# EasyEDA Pro project Modu-PI Motherboard.epro, board PCB1
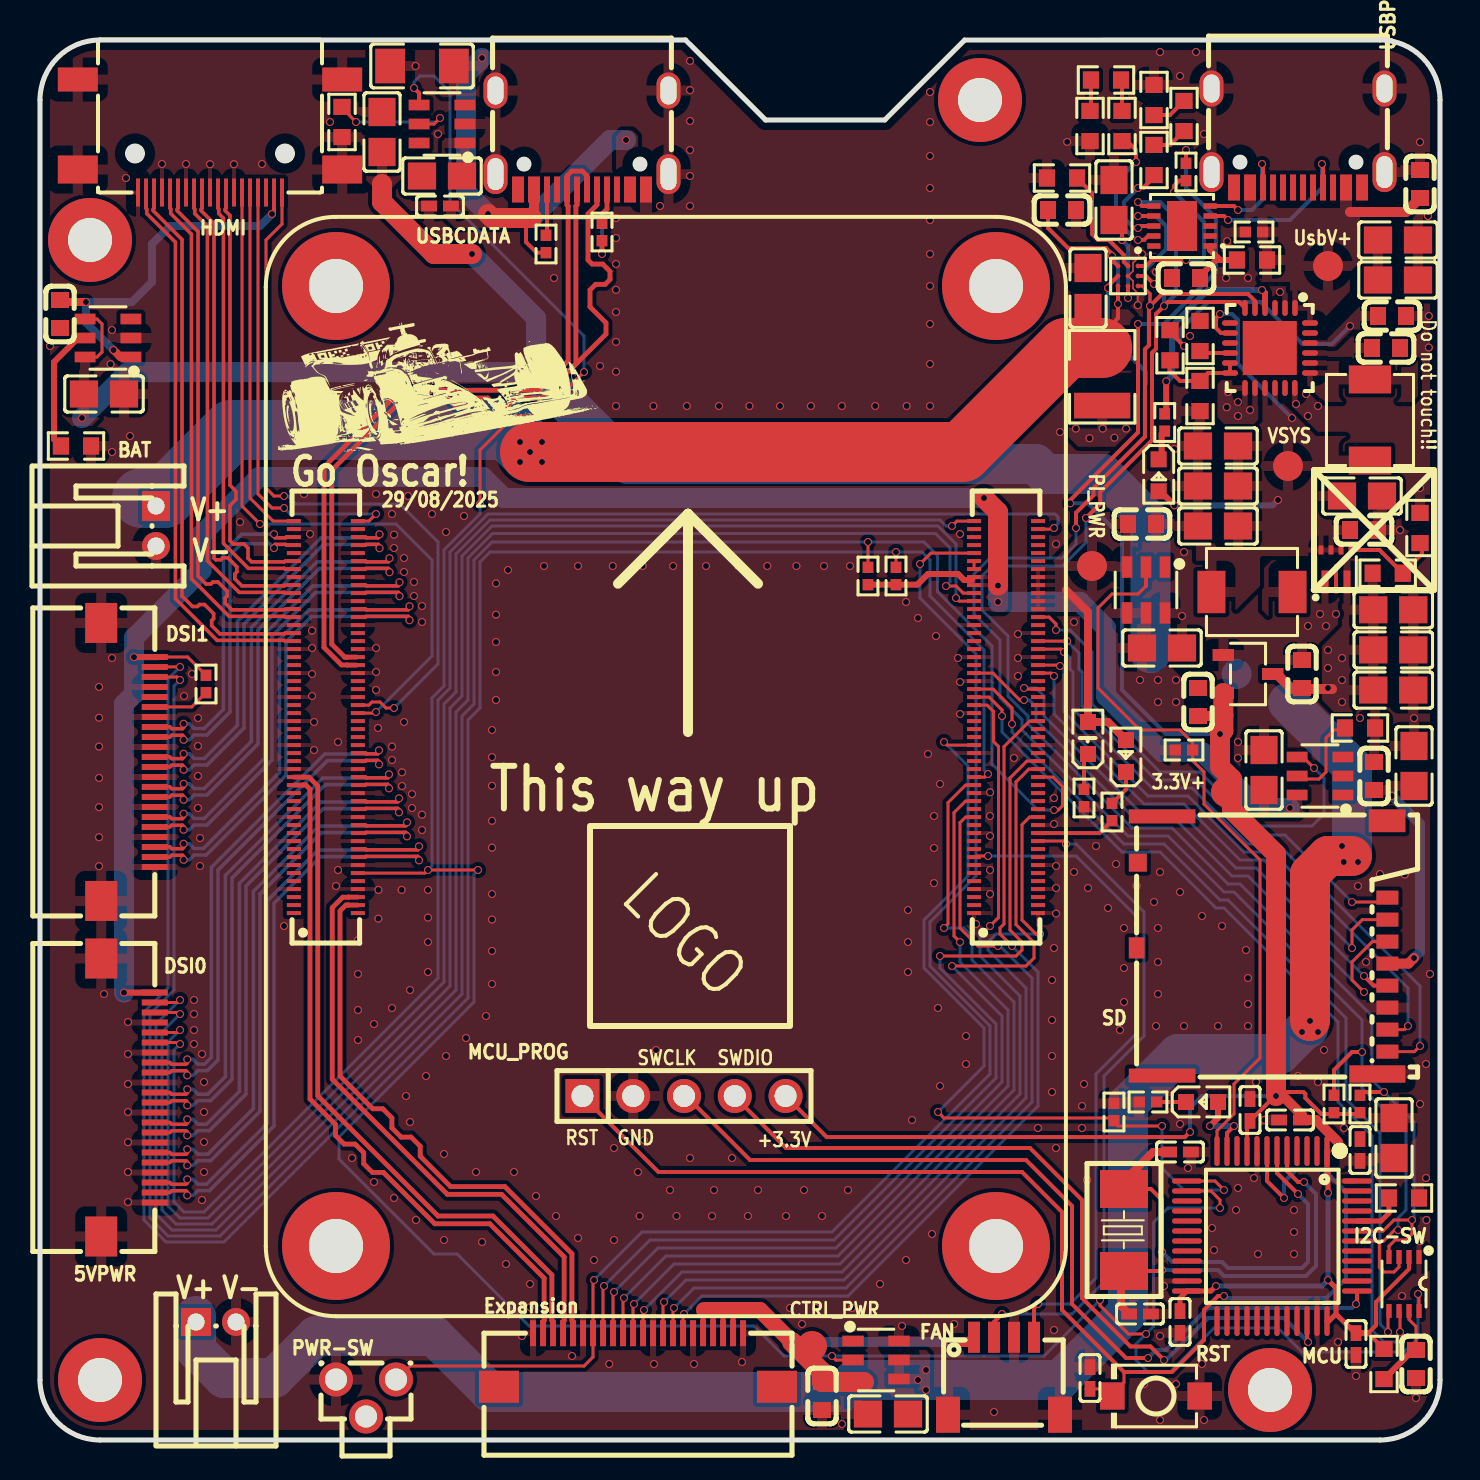
[diagram p1: board, top side]
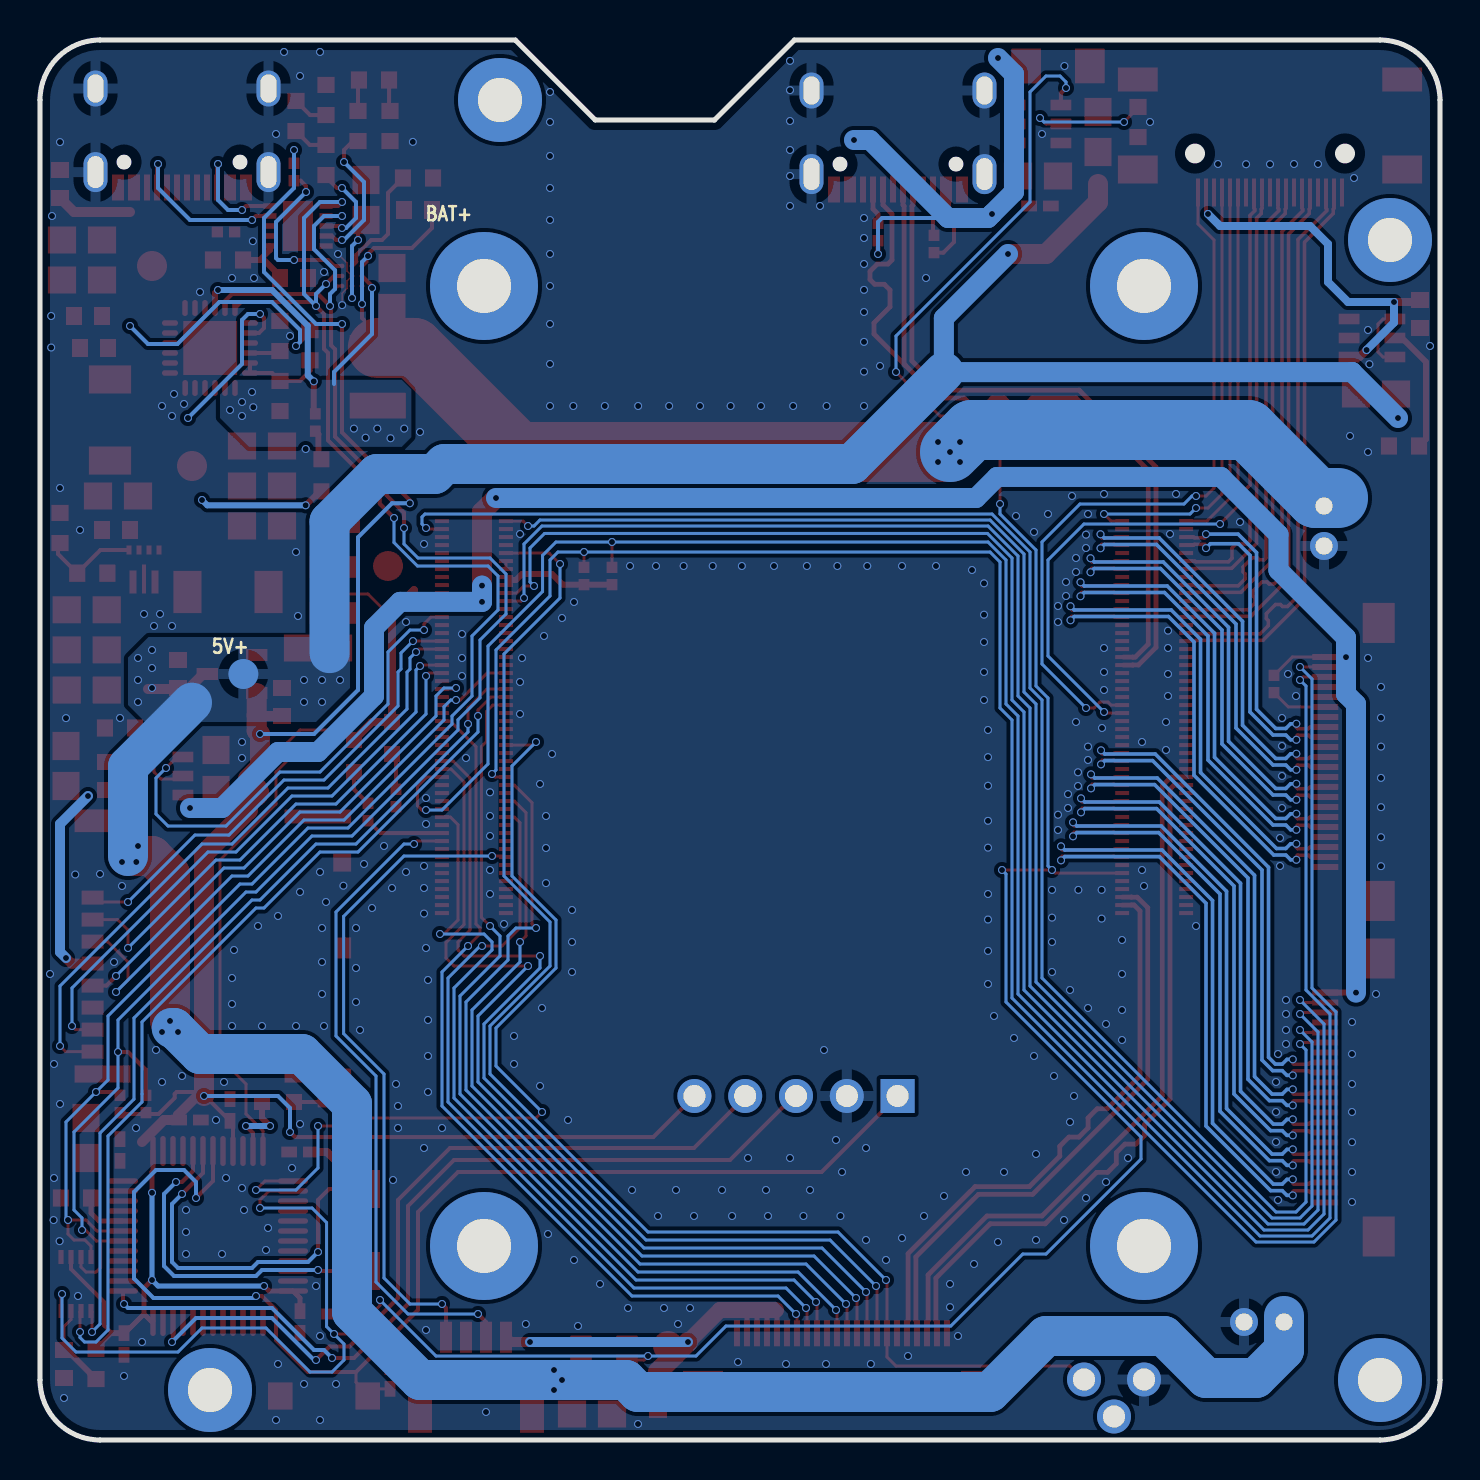
[diagram p2: board, bottom side, seen from below]

Outline 70 x 70 mm; copper layers: Top Layer, Inner1, Inner2, Bottom Layer. Coordinates in mm from the lower left corner of the outline.
Outline path: 0,67 0,3 arc(0.88,0.88) 3,0 67,0 arc(69.12,0.88) 70,3 70,67 arc(69.12,69.12) 67,70 46.23,70 42.24,66 36.28,66 32.28,70 3,70 arc(0.88,69.12) 0,67
Stack: Top Layer 0.035mm 外层铜厚1oz / Dielectric1 0.2104mm 7628 RC49% 8.6mil / Inner1 0.0152mm 内层铜厚 / Dielectric2 1.065mm 1.1mm H/HOZ 含铜 / Inner2 0.0152mm 内层铜厚 / Dielectric3 0.2104mm 7628 RC49% 8.6mil / Bottom Layer 0.035mm 外层铜厚1oz

## Design rules (mm)
net MIPI1_D2_N: 100OHM, MIPI2
net HDMI0_SCL: 100OHM
net MIPI1_D3_P: 100OHM, MIPI1
net MIPI1_D2_P: 100OHM, MIPI2
net HDMI0_SDA: 100OHM
net MIPI1_D3_N: 100OHM, MIPI1
net MIPI1_C_P: 100OHM, MIPI5
net HDMI0_CLK_N: 100OHM, HDMI8
net HDMI0_CLK_P: 100OHM, HDMI8
net MIPI1_C_N: 100OHM, MIPI5
net HDMI0_TX0_N: 100OHM, HDMI7
net MIPI1_D1_P: 100OHM, MIPI3
net HDMI0_TX0_P: 100OHM, HDMI7
net MIPI1_D1_N: 100OHM, MIPI3
net HDMI0_TX1_N: 100OHM, HDMI6
net MIPI1_D0_P: 100OHM, MIPI4
net HDMI0_TX1_P: 100OHM, HDMI6
net MIPI1_D0_N: 100OHM, MIPI4
net HDMI0_TX2_N: 100OHM, HDMI5
net USB3-1-TX_P: 90OHM, USB3
net HDMI0_TX2_P: 100OHM, HDMI5
net USB3-1-TX_N: 90OHM, USB3
net HDMI1_CLK_N: 100OHM, HDMI4
net USB3-1-D_N: 90OHM, USB5
net HDMI1_CLK_P: 100OHM, HDMI4
net USB3-1-D_P: 90OHM, USB5
net HDMI1_TX0_N: 100OHM, HDMI3
net USB3-1-RX_P: 90OHM, USB4
net HDMI1_TX0_P: 100OHM, HDMI3
net USB3-1-RX_N: 90OHM, USB4
net HDMI1_TX1_N: 100OHM, HDMI2
net HDMI0_HOTPLUG: 100OHM
net HDMI1_TX1_P: 100OHM, HDMI2
net HDMI0_CEC: 100OHM
net HDMI1_CEC: 100OHM
net HDMI1_TX2_N: 100OHM, HDMI1
net HDMI1_SCL: 100OHM
net HDMI1_TX2_P: 100OHM, HDMI1
net HDMI1_SDA: 100OHM
net HDMI1_HOTPLUG: 100OHM
net USB3-0-TX_P: 90OHM, USB6
net MIPI0_D3_P: 100OHM, MIPI6
net MIPI0_D3_N: 100OHM, MIPI6
net USB3-0-TX_N: 90OHM, USB6
net USB3-0-D_N: 90OHM, USB8
net MIPI0_D2_P: 100OHM, MIPI7
net USB3-0-D_P: 90OHM, USB8
net MIPI0_D2_N: 100OHM, MIPI7
net MIPI0_C_P: 100OHM, MIPI10
net USB3-0-RX_P: 90OHM, USB7
net USB3-0-RX_N: 90OHM, USB7
net MIPI0_C_N: 100OHM, MIPI10
net MIPI0_D1_P: 100OHM, MIPI8
net MIPI0_D1_N: 100OHM, MIPI8
net MIPI0_D0_P: 100OHM, MIPI9
net MIPI0_D0_N: 100OHM, MIPI9
net USB2_P: 90OHM, USB9
net USB2_N: 90OHM, USB9
template: User Custom Config
spacing copperThickness1oz (default): track to track 0.102, other pairs 0.09 to 0.3
spacing copperThickness2oz: track to track 0.203, other pairs 0.152 to 0.3
track width copperThickness1oz (default): min 0.05, default 0.254, max 4
track width copperThickness2oz: min 0.203, default 0.254, max 2.54
differential pair differentialPair (default): width min 0.127, default 0.254, max 2.54; gap min 0.152, default 0.152
differential pair 100OHM: width min 0.177, default 0.177, max 0.177; gap min 0.15, default 0.15
differential pair 90OHM: width min 0.239, default 0.239, max 0.239; gap min 0.15, default 0.15
via viaSize (default): diameter min 0.4, default 0.61, max 10; hole min 0.3, default 0.305, max 6.3
net GND uses copperRegion1
net MIPI1_D2_N uses 100OHM
net MIPI1_D3_P uses 100OHM
net MIPI1_D2_P uses 100OHM
net MIPI1_D3_N uses 100OHM
net MIPI1_C_P uses 100OHM
net HDMI0_CLK_N uses 100OHM
net HDMI0_CLK_P uses 100OHM
net MIPI1_C_N uses 100OHM
net HDMI0_TX0_N uses 100OHM
net MIPI1_D1_P uses 100OHM
net HDMI0_TX0_P uses 100OHM
net MIPI1_D1_N uses 100OHM
net HDMI0_TX1_N uses 100OHM
net MIPI1_D0_P uses 100OHM
net HDMI0_TX1_P uses 100OHM
net MIPI1_D0_N uses 100OHM
net HDMI0_TX2_N uses 100OHM
net USB3-1-TX_P uses 90OHM
net HDMI0_TX2_P uses 100OHM
net USB3-1-TX_N uses 90OHM
net HDMI1_CLK_N uses 100OHM
net USB3-1-D_N uses 90OHM
net HDMI1_CLK_P uses 100OHM
net USB3-1-D_P uses 90OHM
net HDMI1_TX0_N uses 100OHM
net USB3-1-RX_P uses 90OHM
net HDMI1_TX0_P uses 100OHM
net USB3-1-RX_N uses 90OHM
net HDMI1_TX1_N uses 100OHM
net HDMI1_TX1_P uses 100OHM
net HDMI1_TX2_N uses 100OHM
net HDMI1_TX2_P uses 100OHM
net USB3-0-TX_P uses 90OHM
net MIPI0_D3_P uses 100OHM
net MIPI0_D3_N uses 100OHM
net USB3-0-TX_N uses 90OHM
net USB3-0-D_N uses 90OHM
net MIPI0_D2_P uses 100OHM
net USB3-0-D_P uses 90OHM
net MIPI0_D2_N uses 100OHM
net MIPI0_C_P uses 100OHM
net USB3-0-RX_P uses 90OHM
net USB3-0-RX_N uses 90OHM
net MIPI0_C_N uses 100OHM
net MIPI0_D1_P uses 100OHM
net MIPI0_D1_N uses 100OHM
net MIPI0_D0_P uses 100OHM
net MIPI0_D0_N uses 100OHM
net USB2_P uses 90OHM
net USB2_N uses 90OHM
diff pair MIPI2 uses 100OHM
diff pair MIPI1 uses 100OHM
diff pair MIPI5 uses 100OHM
diff pair HDMI8 uses 100OHM
diff pair HDMI7 uses 100OHM
diff pair MIPI3 uses 100OHM
diff pair HDMI6 uses 100OHM
diff pair MIPI4 uses 100OHM
diff pair HDMI5 uses 100OHM
diff pair USB3 uses 90OHM
diff pair HDMI4 uses 100OHM
diff pair USB5 uses 90OHM
diff pair HDMI3 uses 100OHM
diff pair USB4 uses 90OHM
diff pair HDMI2 uses 100OHM
diff pair HDMI1 uses 100OHM
diff pair USB6 uses 90OHM
diff pair MIPI6 uses 100OHM
diff pair USB8 uses 90OHM
diff pair MIPI7 uses 100OHM
diff pair MIPI10 uses 100OHM
diff pair USB7 uses 90OHM
diff pair MIPI8 uses 100OHM
diff pair MIPI9 uses 100OHM
diff pair USB9 uses 90OHM
pour e2682 uses copperRegion1
pour e1232 uses copperRegion1
pour e576 uses copperRegion1
pour e601 uses copperRegion1
pour e205 uses copperRegion1
pour e148 uses copperRegion1
pour e136 uses copperRegion1
pour e124 uses copperRegion1
pour e149 uses copperRegion1
pour e95 uses copperRegion1
pour e29 uses copperRegion1
pour e36 uses copperRegion1
pour e737 uses copperRegion1
pour e132 uses copperRegion1
pour e47 uses copperRegion1
pour e665 uses copperRegion1
pour e463 uses copperRegion1
pour e5058 uses copperRegion1
pour e92 uses copperRegion1
pour e259 uses copperRegion1
pour e196 uses copperRegion1
pour e108 uses copperRegion1
pour e115 uses copperRegion1
pour e309 uses copperRegion1
pour e218 uses copperRegion1
pour e1586 uses copperRegion1
pour e1592 uses copperRegion1
pour e2314 uses copperRegion1
pour e842 uses copperRegion1
pour e1476 uses copperRegion1
pour e1207 uses copperRegion1

## Placement (name value [footprint] x y rotation side)
5VPWR  S2B-PH-K-S(LF)(SN)  [CONN-TH_S2B-PH-K-S-LF-SN]  8.8 5.9 180 top
BAT  S2B-PH-K-S(LF)(SN)  [CONN-TH_S2B-PH-K-S-LF-SN]  5.8 45.7 90 top
C3  10uF  [C0805]  17.1 65.4 90 top
C6  10uF  [C0805]  20.1 63.2 180 top
C9  10uF  [C0805]  68.7 33.7 90 top
C10  22uF  [C0805]  67.66 37.5 0 top
C11  22uF  [C0805]  67.66 39.5 0 top
C12  22uF  [C0805]  67.66 41.51 0 top
C17  1uF  [C0603]  66.2 45.5 0 top
C25  1uF  [C0603]  63.1 38.3 90 top
C26  10uF  [C0805]  67.7 15.1 90 top
C27  100nF  [C0402]  57 5.9 270 top
C28  100nF  [C0402]  60.5 16.5 90 top
C29  100nF  [C0402]  65.8 4.8 270 top
C30  100nF  [C0402]  62.5 16 180 top
C33  1uF  [C0603]  57.9 36.9 90 top
C38  47uF  [C1206]  19.1 68.7 180 top
C68  100nF  [C0402]  66 14.5 90 top
C69  100nF  [C0402]  52.5 3.1 90 top
C92  20pF  [C0402]  55 6.3 0 top
C93  20pF  [C0402]  57 14.4 0 top
C95  10uF  [C0805]  56.1 39.6 180 top
C96  1uF  [C0603]  55.1 45.8 180 top
C99  1uF  [C0603]  66.7 33.2 270 top
C100  10uF  [C0805]  61.2 33.5 270 top
C104  1uF  [C0603]  69 62.8 270 top
C105  4.7uF  [C0805]  67.9 58 0 top
C106  2.2uF  [C0805]  67.9 60 180 top
C107  47nF  [C0603]  67.3 54.6 180 top
C108  10uF  [C0805]  58.9 49.7 180 top
C109  10uF  [C0805]  58.9 45.7 180 top
C110  10uF  [C0805]  66.1 47.2 0 top
C111  10uF  [C0805]  58.9 47.7 180 top
C112  4.7uF  [C0603]  67.6 56.2 0 top
C113  10uF  [C0805]  52.4 57.6 90 top
C114  1uF  [C0603]  57.3 58.1 0 top
C115  1uF  [C0603]  39.1 2.2 90 top
C116  10uF  [C0805]  42.4 1.3 0 top
C118  100nF  [C0402]  20 61.7 180 top
C119  1uF  [C0603]  1 56.3 90 top
C120  10uF  [C0805]  3.2 52.3 180 top
C122  1uF  [C0603]  51.1 61.5 0 top
C123  2.2uF  [C0805]  53.7 62 270 top
C124  100pF  [C0603]  68.8 3.8 270 top
CN1  DF40C-100DS-0.4V(51)  [CONN-SMD_DF40C-100DS-0.4V-51]  48.3 36.15 270 top
CN2  DF40C-100DS-0.4V(51)  [CONN-SMD_DF40C-100DS-0.4V-51]  14.29 36.15 270 top
DSI0  AFC01-S22FCA-00  [FPC-SMD_P0.5-22P_FGS-XJ-H2.0]  4.4 17.13 90 top
DSI1  AFC01-S22FCA-00  [FPC-SMD_P0.5-22P_FGS-XJ-H2.0]  4.4 33.9 90 top
Expansion  AFC01-S22FCA-00  [FPC-SMD_P0.5-22P_FGS-XJ-H2.0]  29.9 4 180 top
FAN  SM04B-SRSS-TB(LF)(SN)  [CONN-SMD_4P-P1.00_SM04B-SRSS-TB-LF-SN]  48.2 3.2 0 top
HDMI  HDMI-519S  [HDMI-SMD_19P-P0.40-H-F_HDMI-519S]  8.5 65.2 180 top
I2C-SW  PCA9306DCUR  [SSOP-8_L2.0-W2.3-P0.50-LS3.1-BR]  68.2 7.8 90 top
L3  1uH  [IND-SMD_L4.4-W4.2]  60.6 42.4 180 top
L4  1uH  [IND-SMD_L4.4-W4.2]  66.5 51 90 top
LED4  KT-0603R  [LED0603-RD]  58.1 16.9 0 top
LED6  KT-0603R  [LED0603-RD]  55.93 48.23 270 top
LED7  KT-0603W  [LED0603-R-RD_WHITE]  52.4 35.1 90 top
LED8  KT-0603R  [LED0603-RD]  54.3 34.2 90 top
MCU  STM32F103C8T6  [LQFP-48_L7.0-W7.0-P0.50-LS9.0-BL]  61.6 10.2 180 top
MCU_PROG  PZ254V-11-05P  [HDR-TH_5P-P2.54-V-M]  32.2 17.2 0 top
NOREF  -  [Pad_e28]  47 67 0 top
NOREF#2  -  [Pad_e9417]  64.4 58.7 0 top
NOREF#3  -  [Pad_e9423]  59.3 32.4 0 top
NOREF#4  -  [Pad_e11]  2.5 60 0 top
NOREF#5  -  [Pad_e17]  3 3 0 top
NOREF#6  -  [Pad_e9421]  52.6 43.7 0 top
NOREF#7  -  [Pad_e9069]  47.8 9.7 0 top
NOREF#8  -  [Pad_e9425]  59.83 38.3 0 top
NOREF#9  -  [Pad_e9067]  47.8 57.7 0 top
NOREF#10  -  [Pad_e9065]  14.8 57.7 0 top
NOREF#11  -  [Pad_e9427]  38.6 4.7 0 top
NOREF#12  -  [Pad_e9068]  14.8 9.7 0 top
NOREF#13  -  [Pad_e18]  61.5 2.5 0 top
NOREF#14  -  [Pad_e3]  62.4 48.7 0 top
PWR-SW  BX-TS-26-454543BSJ  [sw-th_3p-l4.5-w4.3-p3.00-ls1.9]  16.3 2.1 0 top
R1  2.2kΩ  [R0402]  60.7 60.4 180 top
R3  2.2kΩ  [R0402]  8.3 37.8 270 top
R4  2.2kΩ  [R0402]  41.4 43.2 90 top
R5  2.2kΩ  [R0402]  42.8 43.2 90 top
R29  750kΩ  [R0603]  67.38 43.34 180 top
R30  100kΩ  [R0603]  69 45.6 270 top
R31  10kΩ  [R0603]  68.2 12.1 0 top
R32  1.5kΩ  [R0402]  55.4 16.9 180 top
R37  10kΩ  [R0402]  66 16.8 90 top
R38  10kΩ  [R0402]  64.7 16.8 90 top
R45  56kΩ  [R0402]  25.3 59.8 270 top
R46  56kΩ  [R0402]  28.1 60.4 270 top
R61  10kΩ  [R0603]  56.5 54.74 90 top
R62  10kΩ  [R0603]  58 52.2 90 top
R63  120Ω  [R0603]  58 55.2 90 top
R64  10Ω  [R0603]  60.6 59 0 top
R65  10kΩ  [R0603]  55.7 64 90 top
R66  2kΩ  [R0603]  57.2 66.2 90 top
R67  2kΩ  [R0603]  55.7 67 270 top
R69  5.6kΩ  [R0603]  53.3 68 0 top
R70  15kΩ  [R0603]  54.1 65.7 270 top
R71  2kΩ  [R0603]  52.5 65.7 90 top
R72  10kΩ  [R0402]  57.2 34.5 180 top
R75  2.2kΩ  [R0402]  56.23 50.88 270 top
R76  10kΩ  [R0603]  15.1 65.9 90 top
R77  10kΩ  [R0603]  66 35.6 180 top
R78  10kΩ  [R0603]  1.8 49.7 180 top
R79  10mΩ  [R1210]  53.11 53.16 270 top
R80  10kΩ  [R0603]  51.1 63.1 0 top
R81  10kΩ  [R0402]  57.3 63.4 270 top
R82  10kΩ  [R0402]  53.7 16.4 90 top
R84  2.2kΩ  [R0402]  53.6 31.4 90 top
R85  2.2kΩ  [R0402]  52.2 32.1 90 top
R86  200kΩ  [R0603]  67.2 3.8 90 top
RST  TS-1088-AR02016  [SW-SMD_L3.9-W3.0-P4.45]  55.8 2.2 180 top
SD  5033981892  [TF-SMD_503398-1892]  61.1 24.7 270 top
U9  TPS61022RWUR  [VQFN-7_L2.0-W2.0-P0.55-TL_RWU]  64.8 43.7 90 top
U19  ETA7014S2G  [SOT-23-6_L2.9-W1.6-P0.95-LS2.8-BL]  55.3 42.5 180 top
U23  BQ24192RGER  [QFN-24_L4.0-W4.0-P0.50-BL-EP2.7]  61.5 54.6 180 top
U24  HUSB238_002DD  [DFN-10_L3.0-W3.0-P0.50-BL-EP2.5]  57.1 60.7 90 top
U25  ETA7014S2G  [SOT-23-6_L2.9-W1.6-P0.95-LS2.8-BL]  41.8 4 270 top
U26  XC6206P332MR-G  [SOT-23-3_L2.9-W1.6-P1.90-LS2.8-BR]  60.4 38.3 180 top
U27  AP22615AWU-7  [SOT-26_L3.0-W1.6-P0.95-LS2.8-BL]  20.1 65.8 90 top
U28  AP22615AWU-7  [SOT-26_L3.0-W1.6-P0.95-LS2.8-BL]  64 33.2 90 top
U29  AP22615AWU-7  [SOT-26_L3.0-W1.6-P0.95-LS2.8-BL]  3.4 55.1 90 top
U30  BQ27220YZFR  [DSBGA-9_L1.7-W1.6-R3-C3-P0.50-BL]  54.4 58.2 180 top
USBCDATA  TYPE-C-31-M-12  [USB-C_SMD-TYPE-C-31-M-12]  27.1 65 180 top
USBPWR  TYPE-C-31-M-12  [USB-C_SMD-TYPE-C-31-M-12]  62.9 65.1 180 top
X2  8MHz  [CRYSTAL-SMD_L5.0-W3.2]  54.2 10.5 270 top

## Footprints (pads in the part's own frame, mm; a bottom-side part is the same pattern mirrored in y, then rotated)
C0402
  rect 0.79x0.54 smd: 1(-0.545,0) 2(0.545,0)
C0603
  rect 0.8x0.9 smd: 1(-0.7,0) 2(0.7,0)
C0805
  rect 1.41x1.35 smd: 1(-1,0) 2(1,0)
C1206
  rect 1.485x1.728 smd: 1(-1.593,0) 2(1.593,0)
CONN-SMD_4P-P1.00_SM04B-SRSS-TB-LF-SN
  rect 0.6x1.55 smd: 1(-1.5,1.938) 2(-0.5,1.938) 3(0.5,1.938) 4(1.5,1.938)
  rect 1.2x1.8 smd: 5(2.8,-1.938) 6(-2.8,-1.938)
CONN-SMD_DF40C-100DS-0.4V-51
  rect 0.2x0.7 smd: 1(9.8,1.6) 2(9.8,-1.6) 3(9.4,1.6) 4(9.4,-1.6) 5(9,1.6) 6(9,-1.6) 7(8.6,1.6) 8(8.6,-1.6) 9(8.2,1.6) 10(8.2,-1.6) 11(7.8,1.6) 12(7.798,-1.6) 13(7.4,1.6) 14(7.4,-1.6) 15(7,1.6) 16(7,-1.6) 17(6.6,1.6) 18(6.6,-1.6) 19(6.2,1.6) 20(6.2,-1.6) 21(5.8,1.6) 22(5.8,-1.6) 23(5.4,1.6) 24(5.4,-1.6) 25(5,1.6) 26(5,-1.6) 27(4.6,1.6) 28(4.6,-1.6) 29(4.2,1.6) 30(4.2,-1.6) 31(3.8,1.6) 32(3.8,-1.6) 33(3.4,1.6) 34(3.4,-1.6) 35(3,1.6) 36(3,-1.6) 37(2.6,1.6) 38(2.6,-1.6) 39(2.2,1.6) 40(2.2,-1.6) 41(1.8,1.6) 42(1.8,-1.6) 43(1.4,1.6) 44(1.4,-1.6) 45(1,1.6) 46(1,-1.6) 47(0.6,1.6) 48(0.6,-1.6) 49(0.2,1.6) 50(0.2,-1.6) 51(-0.2,1.6) 52(-0.2,-1.6) 53(-0.6,1.6) 54(-0.6,-1.6) 55(-1,1.6) 56(-1,-1.6) 57(-1.4,1.6) 58(-1.4,-1.6) 59(-1.8,1.6) 60(-1.8,-1.6) 61(-2.2,1.6) 62(-2.2,-1.6) 63(-2.6,1.6) 64(-2.6,-1.6) 65(-3,1.6) 66(-3,-1.6) 67(-3.4,1.6) 68(-3.4,-1.6) 69(-3.8,1.6) 70(-3.8,-1.6) 71(-4.2,1.6) 72(-4.2,-1.6) 73(-4.6,1.6) 74(-4.6,-1.6) 75(-5,1.6) 76(-5,-1.6) 77(-5.4,1.6) 78(-5.4,-1.6) 79(-5.8,1.6) 80(-5.8,-1.6) 81(-6.2,1.6) 82(-6.2,-1.6) 83(-6.6,1.6) 84(-6.6,-1.6) 85(-7,1.6) 86(-7,-1.6) 87(-7.4,1.6) 88(-7.4,-1.6) 89(-7.8,1.6) 90(-7.8,-1.6) 91(-8.2,1.6) 92(-8.2,-1.6) 93(-8.6,1.6) 94(-8.6,-1.6) 95(-9,1.6) 96(-9,-1.6) 97(-9.4,1.6) 98(-9.4,-1.6) 99(-9.8,1.6) 100(-9.8,-1.6)
CONN-TH_S2B-PH-K-S-LF-SN
  rect 1.5x1.4 hole 0.85: 1(1,0)
  round 1.4 hole 0.85: 2(-1,0)
CRYSTAL-SMD_L5.0-W3.2
  rect 1.9x2.4 smd: 1(-2.05,0) 2(2.05,0)
DFN-10_L3.0-W3.0-P0.50-BL-EP2.5
  rect 0.28x0.665 smd: 1(-1,-1.407) 2(-0.5,-1.407) 3(0,-1.407) 4(0.5,-1.407) 5(1,-1.407) 6(1,1.407) 7(0.5,1.407) 8(0,1.407) 9(-0.5,1.407) 10(-1,1.407)
  rect 2.5x1.5 smd: 11(0,0)
DSBGA-9_L1.7-W1.6-R3-C3-P0.50-BL
  round 0.24 smd: A1(-0.5,-0.5) A2(-0.5,0) A3(-0.5,0.5) B1(0,-0.5) B2(0,0) B3(0,0.5) C1(0.5,-0.5) C2(0.5,0) C3(0.5,0.5)
FPC-SMD_P0.5-22P_FGS-XJ-H2.0
  rect 0.3x1.3 smd: 1(-5.252,-1.338) 2(-4.752,-1.338) 3(-4.252,-1.338) 4(-3.752,-1.338) 5(-3.252,-1.338) 6(-2.752,-1.338) 7(-2.252,-1.338) 8(-1.752,-1.338) 9(-1.25,-1.339) 10(-0.752,-1.338) 11(-0.252,-1.338) 12(0.248,-1.338) 13(0.748,-1.338) 14(1.248,-1.338) 15(1.748,-1.338) 16(2.248,-1.338) 17(2.748,-1.338) 18(3.248,-1.338) 19(3.748,-1.338) 20(4.25,-1.339) 21(4.748,-1.338) 22(5.248,-1.338)
  rect 2x1.6 smd: 23(6.95,1.339) 24(-6.95,1.339)
HDMI-SMD_19P-P0.40-H-F_HDMI-519S
  rect 0.2x1.4 smd: 1(3.6,2.825) 2(3.2,2.825) 3(2.8,2.825) 4(2.4,2.825) 5(2,2.825) 6(1.6,2.825) 7(1.2,2.825) 8(0.8,2.825) 9(0.4,2.825) 10(0,2.824) 11(-0.4,2.825) 12(-0.8,2.825) 13(-1.2,2.825) 14(-1.6,2.825) 15(-2,2.825) 16(-2.4,2.825) 17(-2.8,2.825) 18(-3.2,2.825) 19(-3.6,2.825)
  rect 2x1.2 smd: 20(6.61,-2.825) 21(-6.61,-2.825)
  rect 2x1.4 smd: 22(6.61,1.675) 23(-6.61,1.675)
HDR-TH_5P-P2.54-V-M
  rect 1.7x1.7 hole 1.1: 1(-5.08,0)
  round 1.7 hole 1.1: 2(-2.54,0) 3(0,0) 4(2.54,0) 5(5.08,0)
IND-SMD_L4.4-W4.2
  rect 1.4x2.12 smd: 1(2.028,0) 2(-2.028,0)
LED0603-R-RD_WHITE
  rect 0.8x0.8 smd: 1(0.8,0) 2(-0.8,0)
LED0603-RD
  rect 0.8x0.8 smd: 1(-0.799,0) 2(0.799,0)
LQFP-48_L7.0-W7.0-P0.50-LS9.0-BL
  oval 0.27x1.5 smd: 1(-2.75,-4.25) 2(-2.25,-4.25) 3(-1.75,-4.25) 4(-1.25,-4.25) 5(-0.75,-4.25) 6(-0.25,-4.25) 7(0.25,-4.25) 8(0.75,-4.25) 9(1.25,-4.25) 10(1.75,-4.25) 11(2.25,-4.25) 12(2.75,-4.25) 25(2.75,4.25) 26(2.25,4.25) 27(1.75,4.25) 28(1.25,4.25) 29(0.75,4.25) 30(0.25,4.25) 31(-0.25,4.25) 32(-0.75,4.25) 33(-1.25,4.25) 34(-1.75,4.25) 35(-2.25,4.25) 36(-2.75,4.25)
  oval 1.5x0.27 smd: 13(4.25,-2.75) 14(4.25,-2.25) 15(4.25,-1.75) 16(4.25,-1.25) 17(4.25,-0.75) 18(4.25,-0.25) 19(4.25,0.25) 20(4.25,0.75) 21(4.25,1.25) 22(4.25,1.75) 23(4.25,2.25) 24(4.25,2.75) 37(-4.25,2.75) 38(-4.25,2.25) 39(-4.25,1.75) 40(-4.25,1.25) 41(-4.25,0.75) 42(-4.25,0.25) 43(-4.25,-0.25) 44(-4.25,-0.75) 45(-4.25,-1.25) 46(-4.25,-1.75) 47(-4.25,-2.25) 48(-4.25,-2.75)
Pad_e3
  round 1.5 smd: TP1(0,0)
Pad_e11
  round 4.2 hole 2.2: 101(0,0)
Pad_e17
  round 4.2 hole 2.2: 101(0,0)
Pad_e18
  round 4.2 hole 2.2: 101(0,0)
Pad_e28
  round 4.2 hole 2.2: 101(0,0)
Pad_e9065
  round 5.4 hole 2.7: 102(0,0)
Pad_e9067
  round 5.4 hole 2.7: 102(0,0)
Pad_e9068
  round 5.4 hole 2.7: 102(0,0)
Pad_e9069
  round 5.4 hole 2.7: 102(0,0)
Pad_e9417
  round 1.5 smd: TP1(0,0)
Pad_e9421
  round 1.5 smd: TP5(0,0)
Pad_e9423
  round 1.5 smd: TP7(0,0)
Pad_e9425
  round 1.5 smd far side: TP9(0,0)
Pad_e9427
  round 1.5 smd: TP11(0,0)
QFN-24_L4.0-W4.0-P0.50-BL-EP2.7
  oval 0.28x0.8 smd: 1(-1.25,-2) 2(-0.75,-2) 3(-0.25,-2) 4(0.25,-2) 5(0.75,-2) 6(1.25,-2) 13(1.25,2) 14(0.75,2) 15(0.25,2) 16(-0.25,2) 17(-0.75,2) 18(-1.242,2)
  oval 0.8x0.28 smd: 7(2,-1.25) 8(2,-0.75) 9(2,-0.25) 10(2,0.25) 11(2,0.75) 12(2,1.25) 19(-2,1.25) 20(-2,0.75) 21(-2,0.25) 22(-2,-0.25) 23(-2,-0.75) 24(-2,-1.25)
  rect 2.7x2.7 smd: 25(0.013,0)
R0402
  rect 0.566x0.54 smd: 1(-0.433,0) 2(0.433,0)
R0603
  rect 0.806x0.864 smd: 1(-0.753,0) 2(0.753,0)
R1210
  rect 1.282x2.808 smd: 1(-1.441,0) 2(1.441,0)
SOT-23-3_L2.9-W1.6-P1.90-LS2.8-BR
  rect 1.07x0.6 smd: 1(1.235,-0.95) 2(1.235,0.95) 3(-1.235,0)
SOT-23-6_L2.9-W1.6-P0.95-LS2.8-BL
  rect 0.532x1.072 smd: 1(-0.95,-1.149) 2(0,-1.149) 3(0.95,-1.149) 4(0.95,1.149) 5(0,1.149) 6(-0.95,1.149)
SOT-26_L3.0-W1.6-P0.95-LS2.8-BL
  rect 0.532x1.04 smd: 1(-0.95,-1.145) 2(0,-1.145) 3(0.95,-1.145) 4(0.95,1.145) 5(0,1.145) 6(-0.95,1.145)
SSOP-8_L2.0-W2.3-P0.50-LS3.1-BR
  rect 0.7x0.26 smd: 1(1.35,-0.75) 2(1.35,-0.25) 3(1.35,0.25) 4(1.35,0.75) 5(-1.35,0.75) 6(-1.35,0.25) 7(-1.35,-0.25) 8(-1.35,-0.75)
SW-SMD_L3.9-W3.0-P4.45
  rect 1.23x1.36 smd: 1(-2.185,0) 2(2.185,0)
sw-th_3p-l4.5-w4.3-p3.00-ls1.9
  round 1.7 hole 1.1: 1(-1.5,0.925) 2(1.5,0.925) 3(0,-0.925)
TF-SMD_503398-1892
  rect 0.7x1.1 smd: 1(-2.42,6.27) 2(-1.32,6.27) 3(-0.22,6.27) 4(0.88,6.27) 5(1.98,6.27) 6(3.08,6.27) 7(4.18,6.27) 8(5.28,6.27)
  rect 1.05x0.78 smd: 9(0.095,-6.27)
  rect 0.9x0.9 smd: 10(-4.17,-6.21)
  rect 0.7x3.33 smd: 11(-6.48,-4.995) 11(6.48,-4.995)
  rect 1.14x1.83 smd: 11(-6.26,6.255)
  rect 0.86x2.8 smd: 11(6.4,5.77)
USB-C_SMD-TYPE-C-31-M-12
  oval 1.2x2 hole 0.8x1.6: 0(-4.325,1.706) 1(4.325,1.706)
  oval 1.2x1.8 hole 0.8x1.4: 2(4.325,-2.474) 3(-4.325,-2.474)
  rect 0.3x1.3 smd: A1(-3.35,2.474) A4(-2.55,2.474) A5(-1.25,2.474) A6(-0.25,2.474) A7(0.25,2.474) A8(1.25,2.474) A9(2.55,2.474) A12(3.35,2.474) B1(3.05,2.474) B4(2.25,2.474) B5(1.75,2.474) B6(0.75,2.474) B7(-0.75,2.474) B8(-1.75,2.474) B9(-2.25,2.474) B12(-3.05,2.474)
VQFN-7_L2.0-W2.0-P0.55-TL_RWU
  rect 1.15x0.35 smd: 1(-0.8,0.55) 3(-0.8,-0.55)
  rect 1.45x0.2 smd: 2(-0.65,0)
  rect 0.45x0.25 smd: 4(0.8,-0.75) 5(0.8,-0.25) 6(0.8,0.25) 7(0.8,0.75)

## Nets
As in the schematic, except:
5V_CTRL: C115.2 Expansion.2 Expansion.3 Expansion.4 Expansion.5 FAN.1 NOREF#11.TP11 U25.3
+3.3VI: C26.1 C27.1 C28.1 C29.1 C30.1 C33.1 C68.1 I2C-SW.2 MCU.1 MCU.9 MCU.24 MCU.36 MCU.48 MCU_PROG.5 NOREF#3.TP7 R37.1 R38.1 R81.1 R86.2 U26.2
+5V: 5VPWR.1 C3.1 C10.1 C11.1 C12.1 C25.1 C95.2 C116.2 C120.2 NOREF#8.TP9 R29.2 U9.3 U19.4 U19.5 U25.4 U25.5 U26.3 U27.6 U29.4 U29.6
PI_PWR: C96.2 CN1.77 CN1.79 CN1.81 CN1.83 CN1.85 CN1.87 LED7.1 LED8.2 NOREF#6.TP5 U19.3
USB_V+: C104.2 NOREF#2.TP1 R1.1 R64.2 U23.1 U23.24 USBPWR.A4 USBPWR.A9 USBPWR.B4 USBPWR.B9
VSYS: C17.1 C108.1 C109.1 C110.1 C111.1 L3.1 L4.2 LED6.2 NOREF#14.TP1 U9.5 U9.6 U9.7 U23.8 U23.15 U23.16

Pads without a net: DSI1 18; Expansion 23 24; HDMI 17; MCU 2 3 4 10 15 16 17 18 19 20 21 22 25 26 27 28 29 30 31 32 33 38 39 40 41 45 46; NOREF 101; NOREF#4 101; NOREF#5 101; NOREF#7 102; NOREF#9 102; NOREF#10 102; NOREF#12 102; NOREF#13 101; PWR-SW 3; SD 9 10; U19 1; U23 3 7; U24 2 3 10; U25 1; U27 3; U28 3; U29 3; USBCDATA A8 B8; USBPWR A6 A7 A8 B6 B7 B8

## Via types
v1: diameter 0.4, hole 0.3, Top Layer to Bottom Layer, 593 vias

## Routing (per net, layer and track width the routed paths; a pad name or vN(x,y) marks a point on that pad's centre or on a via; arc(x,y) is an arc through that point)
5V_CTRL: length 24.5
  Top Layer w0.25: 33.65,5.14 33.65,6.5 33.65,6.5 ; 33.2,6.5 33.15,6.45 33.15,5.14 ; 34.15,5.14 34.15,6.47 34.12,6.5 ; 34.58,6.5 34.65,6.43 34.65,5.14
  Top Layer w0.5: FAN.1 46.46,4.9 v1(45.5,4.9)
  Top Layer w0.8: v1(37.6,4.9) 36,6.5 33.2,6.5
  Top Layer w1: v1(37.6,4.9) 39.1,3.4 C115.2 41.2,2.9
  Bottom Layer w0.5: v1(45.5,4.9) v1(37.6,4.9)
+1.8V: length 0.4
  Top Layer w0.15: CN1.90 CN1.88
+3.3V: length 102.8
  Top Layer w0.15: 8.3,38.23 7.38,39.15 5.91,39.15
  Top Layer w0.3: 5.91,39.15 5.9,39.14 v1(4.7,39.14) ; 46.6,43 46.2,43 45.9,43.3 44.4,43.3 43.87,42.77 41.4,42.77 ; 5.91,22.38 5.9,22.37 v1(4.2,22.37)
  Top Layer w1: v1(47.9,42.72) 47.9,46.4 v1(47.2,47.1)
  Bottom Layer w1: v1(47.9,42.72) v1(47.9,41.91) 52,41.91 53.3,40.61 53.3,37.2 56.1,34.4 58.1,34.4 60.9,31.6 v1(62.5,31.6) ; v1(47.2,47.1) 23.2,47.1 22.15,48.15 10.95,48.15 8.08,45.28 8.08,43.49 4.7,40.11 v1(4.7,39.14) 4.7,37.3 4.2,36.8 v1(4.2,22.37)
+3.3VI: length 126.7
  Top Layer w0.2: v1(57.3,64.5) R81.1 ; v1(51.51,46.84) 51.51,46.99 54.9,50.38 v1(54.9,55.8) ; R86.2 66.41,5.34 66.8,5.74 66.8,6.9 68.45,8.55 I2C-SW.2 ; v1(57.5,15.4) 57.25,15.15 39.33,15.15 MCU_PROG.5 ; R37.1 65.93,16.3 64.07,16.3 63.27,17.1 63.27,17.3 63.17,17.4 62,17.4 v1(61.8,17.2) 61.75,17.2 C28.1 60.35,15.8 MCU.9
  Top Layer w0.25: v1(64.4,8) 64.8,7.6 64.8,6.3 ; C27.1 57,7.1 MCU.24 58.55,7.45 v1(58.8,7.7) ; 64.8,6.3 64.45,5.95 MCU.36 ; 64.8,6.3 65.75,5.34 C29.1 ; v1(64.4,12.36) 64.4,13.4 64.35,13.45 MCU.1
  Top Layer w0.3: 66.41,5.34 C29.1
  Top Layer w0.5: 64.9,14.9 63.8,16 C30.1 63.1,16.05 63.1,16.24 62.15,17.2 v1(61.8,17.2) ; C33.1 59.13,36.2
  Top Layer w1: 59.13,36.2 59.16,36.23 ; 59.16,36.23 U26.2 ; 59.16,36.23 59.16,35.46 v1(59,35.3) 59,33.65 59.6,33.05 59.6,31.5 61.8,29.3 v1(61.8,17.2)
  Bottom Layer w0.2: v1(61.8,17.2) 58.1,17.2 57.5,16.6 v1(57.5,15.4) ; v1(54.9,55.8) 56.2,55.8 58.8,58.4 58.8,61.1 57.3,62.6 v1(57.3,64.5) ; v1(59,35.3) 56.3,35.3 54.1,37.5 54.1,45.14 52.4,46.84 v1(51.51,46.84)
  Bottom Layer w0.25: v1(58.8,7.7) 64.1,7.7 v1(64.4,8) v1(64.4,12.36)
+5V: length 176.8
  Top Layer w0.15: U29.6 2.85,54.15 3.1,54.4 3.1,55.8 2.85,56.05 U29.4
  Top Layer w0.5: U26.3 61.84,38.3 62.59,37.55 63.05,37.55 ; 63.05,37.55 C25.1 ; 63.05,37.55 64.6,37.55
  Top Layer w1: v1(21.6,59.3) 19.7,59.3 17.1,61.9 17.1,62.8
  Top Layer w1.5: 63.5,20.7 v1(63.5,20.95)
  Top Layer w2: 65.6,29.2 64.4,29.2 63.5,28.3 v1(63.5,20.95)
  Bottom Layer w1: v1(21.6,59.3) 24.81,56.09 24.81,53.39 4.41,53.39 4.4,53.4 v1(2.1,51.1)
  Bottom Layer w2: 44.13,3 51,3 54.4,6.4 54.4,16.8 56.9,19.3 62,19.3 v1(63.1,20.4) 63.3,20.6 63.41,20.6 ; 65.6,29.2 65.6,33.67 62.4,36.87 ; v1(43.9,3) 40.7,3 40.1,2.4 22.5,2.4 19.7,5.2 13.8,5.2 11.7,3.1 9.2,3.1 7.8,4.5 7.8,6.2 ; 55.52,39.34 55.52,45.92 53.15,48.3 50.28,48.3 49.78,48.8 29.4,48.8 24.81,53.39
  vias: v1(44.3,3.5) v1(44.3,2.5) v1(55,38) v1(55.9,38) v1(55.9,36.9) v1(56.8,38) v1(56.8,36.9) v1(63.9,20.4) v1(64.4,39.5) v1(64.4,38.6) v1(64.4,37.6) v1(65.1,39.1) v1(65.1,38) v1(65.1,36.9) v1(65.1,29.7) v1(65.19,28.9) v1(65.9,28.9)
GND: length 3.1
  Top Layer w0.078: v1(55.1,59.3) 54.65,58.85 54.65,58.45 U30.B2 54.65,57.95 54.65,57.58 54.89,57.33 v1(54.89,56.74)
  vias: v1(0.5,54.7) v1(2.95,37.66) v1(2.95,36.11) v1(2.95,34.67) v1(2.95,33.11) v1(2.95,31.64) v1(2.95,30.14) v1(2.95,28.69) v1(3.2,22.3) v1(3.53,53.79) v1(3.6,55.5) v1(3.6,49.4) v1(3.6,39.1) v1(4.3,63.1) v1(4.4,20.9) v1(4.4,19.3) v1(4.4,17.8) v1(4.4,16.4) v1(4.4,14.89) v1(4.4,13.4) v1(4.4,11.9) v1(4.5,50.2) v1(6.1,63.8) v1(7.2,37.2) v1(7.3,63.8) v1(7.6,38.3) v1(7.7,22) v1(7.7,21.3) v1(7.7,20.5) v1(7.7,19.8) v1(7.9,36.1) v1(7.9,34.7) v1(7.9,33.2) v1(7.9,31.6) v1(8,30.1) v1(8,28.7) v1(8.1,19.3) v1(8.1,12) v1(8.2,17.9) v1(8.2,16.4) v1(8.2,14.9) v1(8.2,13.4) v1(8.5,63.79) v1(9.7,63.79) v1(10,45.9) v1(11.1,63.8) v1(12.2,25.7) v1(13.2,47.3) v1(13.5,45.3) v1(13.6,40.47) v1(13.6,39.6) v1(13.6,38.3) v1(13.6,37.2) v1(13.7,35.9) v1(13.7,34.5) v1(14.5,65.9) v1(14.8,27.7) v1(14.9,34.9) v1(14.9,28.5) v1(15.6,14.1) v1(15.9,25) v1(15.9,23.3) v1(15.9,21.5) v1(15.9,20) v1(16.7,20.8) v1(16.7,12.9) v1(16.8,47.3) v1(16.8,39.6) v1(16.8,38.4) v1(16.8,37.5) v1(16.9,35.6) v1(16.92,27.5) v1(16.92,26.07) v1(17.6,46.3) v1(17.6,34.67) v1(17.6,34) v1(17.6,21.6) v1(17.7,45.27) v1(17.7,44.6) v1(17.7,12.1) v1(18.1,33.39) v1(18.1,32.7) v1(18.08,27.5) v1(18.2,44.1) v1(18.2,43.4) v1(18.2,35.9) v1(18.3,17.2) v1(18.4,47.2) v1(18.5,22.5) v1(18.5,15.9) v1(18.6,32.29) v1(18.6,31.6) v1(18.7,42.9) v1(18.7,42.2) v1(18.78,68.7) v1(18.8,11) v1(19.1,41.7) v1(19.1,40.9) v1(19.1,31.26) v1(19.1,30.5) v1(19.3,18.2) v1(19.4,27.5) v1(19.4,26.12) v1(19.4,24.9) v1(19.4,23.4) v1(19.6,46.3) v1(19.9,65.3) v1(20.2,14.3) v1(20.2,10) v1(20.3,45.4) v1(20.3,19.2) v1(21.2,46.2) v1(21.3,20.1) v1(21.8,13.4) v1(22.1,9.9) v1(22.3,21.2) v1(22.6,35.5) v1(22.6,34.14) v1(22.6,32.71) v1(22.6,30.96) v1(22.6,29.62) v1(22.6,27.3) v1(22.6,26.02) v1(22.6,24.45) v1(22.6,22.8) v1(22.8,42.83) v1(22.8,41.26) v1(22.8,39.9) v1(22.8,38.4) v1(22.8,37) v1(23.3,8.8) v1(23.4,43.5) v1(23.7,13.4) v1(24.1,5.2) v1(24.5,7.8) v1(24.5,6.64) v1(24.8,12.2) v1(25.2,43.7) v1(25.7,58.1) v1(25.8,11.2) v1(26.6,4.2) v1(26.9,43.7) v1(26.9,10.1) v1(27.7,9) v1(28,53.7) v1(28.46,3.8) v1(28.64,43.7) v1(28.7,14.6) v1(28.7,10) v1(28.8,61.1) v1(28.8,60.1) v1(28.8,58.8) v1(28.8,57.51) v1(28.8,56.4) v1(28.8,54.91) v1(28.8,53.42) v1(28.8,51.7) v1(29.9,13.4) v1(29.98,11.2) v1(30.13,43.7) v1(30.2,15) v1(30.67,51.7) v1(30.7,3.8) v1(30.8,19.5) v1(31,61.7) v1(31.5,12.5) v1(31.66,43.7) v1(31.83,11.2) v1(32.34,51.7) v1(32.5,68.96) v1(32.5,67.49) v1(32.5,65.95) v1(32.5,64.5) v1(32.5,63.2) v1(32.5,61.7) v1(32.5,14.1) v1(32.7,3.8) v1(33.3,43.7) v1(33.6,11.2) v1(33.7,12.5) v1(33.95,51.7) v1(34.6,14.1) v1(34.91,43.7) v1(35.1,3.9) v1(35.4,11.2) v1(35.47,51.7) v1(35.9,12.5) v1(36.36,43.7) v1(37,51.7) v1(37.3,11.2) v1(37.5,6.6) v1(37.82,43.7) v1(38.1,5.8) v1(38.2,12.5) v1(38.54,51.7) v1(38.8,6.6) v1(39.1,11.2) v1(39.2,43.7) v1(40.09,51.7) v1(40.1,0.8) v1(40.4,12.5) v1(40.5,43.7) v1(40.6,6.6) v1(41.76,51.7) v1(42,7.8) v1(43.1,5.7) v1(43.34,51.7) v1(43.3,41.9) v1(43.3,9) v1(43.4,26.5) v1(43.4,24.9) v1(43.4,23.4) v1(43.6,16) v1(43.9,41.1) v1(44.4,34.3) v1(44.5,67.4) v1(44.5,65.9) v1(44.5,64.2) v1(44.5,62.6) v1(44.5,61) v1(44.5,59.3) v1(44.5,57.7) v1(44.5,55.8) v1(44.5,53.8) v1(44.5,51.7) v1(44.6,10.3) v1(44.7,31.2) v1(44.7,29.6) v1(44.7,27.84) v1(44.8,40.2) v1(44.9,21.6) v1(45,32.8) v1(45,17.7) v1(45.71,5.8) v1(45.9,39.1) v1(46,45.3) v1(46,37.9) v1(46,36.3) v1(46.3,20.2) v1(46.3,18.8) v1(46.8,25.8) v1(47.5,32.39) v1(47.5,31.2) v1(47.5,30.2) v1(47.5,28.5) v1(47.5,27.3) v1(47.7,1.4) v1(48.7,34.1) v1(48.9,40.3) v1(48.9,39.1) v1(48.9,38.2) v1(49.9,15.6) v1(50.6,23) v1(50.6,21) v1(50.6,19.2) v1(50.6,17.4) v1(50.7,32.1) v1(50.7,30.8) v1(50.7,24.6) v1(50.7,5.5) v1(50.8,44.8) v1(50.8,28.7) v1(50.8,27.6) v1(50.8,26.32) v1(50.8,14.6) v1(51,50.4) v1(51.36,64.91) v1(51.7,40.9) v1(51.7,28.4) v1(52.1,16.7) v1(52.1,15.6) v1(52.2,17.8) v1(52.35,13) v1(52.4,27.6) v1(52.8,29.7) v1(53.4,26.6) v1(53.8,28.8) v1(54,20.5) v1(54.2,25.6) v1(54.2,23.6) v1(54.2,21.9) v1(54.83,27.71) v1(55.2,2.8) v1(55.7,26.9) v1(55.8,58.4) v1(55.8,20.7) v1(55.9,25.6) v1(55.9,23.9) v1(55.9,22.3) v1(56,69.4) v1(56,28.4) v1(56,5.2) v1(56,1) v1(56.2,7.7) v1(56.71,49.55) v1(56.8,2.8) v1(57,68.2) v1(57,27.4) v1(57,15.8) v1(57.1,41.2) v1(57.2,44.4) v1(57.2,20.7) v1(57.4,13.6) v1(57.5,55.2) v1(57.8,69.4) v1(58.1,26.2) v1(58.1,3.8) v1(58.2,65.3) v1(58.2,1) v1(58.6,10.6) v1(58.7,9.5) v1(58.9,20.7) v1(59.1,25.7) v1(59.3,58.1) v1(59.36,59.94) v1(59.8,11.5) v1(59.9,34.9) v1(59.9,34.1) v1(59.9,12.6) v1(60.3,24.5) v1(60.4,58.1) v1(60.4,23.1) v1(60.4,21.8) v1(60.4,20.7) v1(60.7,13.1) v1(60.8,17.9) v1(60.9,9.3) v1(61.2,16) v1(62,57.4) v1(62.7,11.5) v1(62.7,10.4) v1(62.7,9.3) v1(62.8,51.8) v1(62.9,18.2) v1(63.3,52.3) v1(63.4,51.2) v1(63.4,40.7) v1(63.9,51.7) v1(63.9,17.9) v1(64,41.3) v1(64.2,19.5) v1(64.3,40.7) v1(64.8,41.3) v1(64.9,4.9) v1(65.2,15.6) v1(65.8,3.2) v1(65.9,27.7) v1(66,36.1) v1(66.3,23.9) v1(67,28.3) v1(68,45.5) v1(68.1,7.2) v1(68.24,28.27) v1(68.7,36.09) v1(68.8,2.1) v1(69,64.9) v1(69,47.6) v1(69,16.8) v1(69.02,9.94) v1(69.3,18.8) v1(69.3,13.1) v1(69.32,11) v1(69.4,61.2) v1(69.44,56.2) v1(69.44,54.62) v1(69.5,23.3)
VBUS_EN: length 152.4
  Top Layer w0.15: v1(59,11.6) 59,12 58.55,12.45 MCU.14 ; v1(39.6,4.2) 39.8,4 U25.2 ; I2C-SW.8 68.95,7.25 v1(68.9,7.3) ; v1(53,7) 53,6.72 54.43,5.3 v1(55.3,5.3) ; 15.83,28.35 19.25,28.35 v1(19.4,28.5) v1(21.9,28.5) ; v1(22,46.8) 22,49.5 23.7,51.2 25,51.2 v1(27.2,53.4)
  Top Layer w0.2: v1(18.7,67.6) 18.96,67.34 18.96,66.75
  Bottom Layer w0.15: v1(68.9,7.3) 68.9,5.1 68.2,4.4 63.1,4.4 61.9,5.6 58.7,5.6 56.5,3.4 55.4,3.4 54.8,4 54.8,4.8 v1(55.3,5.3) 55.67,5.67 55.67,10.87 56.4,11.6 v1(59,11.6) ; v1(22,46.8) 22,46.3 20.2,44.5 20.2,37.7 19.6,37.1 19.6,28.7 v1(19.4,28.5) ; v1(21.9,28.5) 21.7,28.3 21.7,21.9 14.95,15.15 14.95,14.05 19.7,9.3 20.86,9.3 24.46,5.7 35.7,5.7 37.2,4.2 v1(39.6,4.2) 50.2,4.2 v1(53,7) ; v1(18.7,67.6) 18.7,67.9 19,68.2 19.7,68.2 20.5,67.4 20.5,61.9 27.2,55.2 v1(27.2,53.4)
BAT+: length 61.3
  Top Layer w0.2: U30.C3 v1(53.9,56.8) 53.9,56.1 53.8,56 ; 50.4,61.17 50.4,60.6 51.4,59.6 53.3,59.6 53.6,59.3 v1(53.6,59.2) 53.68,59.12 53.68,58.92 U30.C1
  Top Layer w3: v1(24.5,49.4) 46.1,49.4 51.3,54.6 R79.1
  Bottom Layer w0.2: v1(53.9,56.8) 53.9,58.9 v1(53.6,59.2)
  Bottom Layer w3: v1(24.5,49.4) v1(24,49.9) 23.4,50.5 9.6,50.5 6.2,47.1 5.1,47.1
  vias: v1(24,48.9) v1(25.1,49.9) v1(25.1,48.9)
BAT_IN: length 6.4
  Top Layer w0.2: U30.C2 53.4,57.7 v1(53.4,57.6)
  Bottom Layer w0.2: v1(53.4,57.6) 53.4,55.3 55.3,53.4 55.3,52.8
  vias: v1(51.79,50.57) v1(52.47,50.09) v1(53.14,50.57) v1(53.72,50.11) v1(54.3,50.57) v1(59.34,51.64) v1(59.4,52.4) v1(59.9,51.9) v1(59.9,51.2) v1(60.5,51.5)
BCK: length 44.3
  Top Layer w0.15: v1(48.6,24.7) 48,25.3 48,25.6 48.2,25.8 48.2,34.67 49.48,35.95 CN1.49 ; v1(32.2,6.3) 32.15,6.25 32.15,5.14
  Bottom Layer w0.15: v1(32.2,6.3) 33.1,7.2 40.4,7.2 49.9,16.7 49.9,23.4 v1(48.6,24.7)
CAM_GPIO0: length 81.7
  Top Layer w0.15: 49.84,45.55 50.65,45.55 v1(50.7,45.6) ; 5.91,19.88 6.92,19.88 v1(7,19.8)
  Bottom Layer w0.15: v1(7,19.8) 6.7,19.5 6.7,11.9 7.2,11.4 8.2,11.4 19.9,23.1 19.9,37 20.5,37.6 20.5,44.4 22.4,46.3 50.75,46.3 50.9,46.15 50.9,45.8 v1(50.7,45.6)
CAM_GPIO1: length 77.7
  Top Layer w0.15: 5.91,20.38 6.88,20.38 v1(7,20.5) ; v1(45.6,45.7) 45.85,45.95 46.76,45.95
  Bottom Layer w0.15: v1(7,20.5) 6.4,19.9 6.4,11.7 7,11.1 8.4,11.1 20.2,22.9 20.2,36.8 20.8,37.4 20.8,44.3 22.5,46 45,46 45.3,45.7 v1(45.6,45.7)
CC1: length 8.9
  Top Layer w0.2: v1(64.1,63.8) 64.15,63.75 USBPWR.A5 ; 58.31,61.2 59.2,61.2 v1(59.4,61)
  Bottom Layer w0.2: v1(64.1,63.8) 64.1,62.6 62.5,61 v1(59.4,61)
CC2: length 6.1
  Top Layer w0.2: USBPWR.B5 61.15,63.75 v1(61.1,63.8) ; v1(59.9,61.5) 59.7,61.7 58.31,61.7
  Bottom Layer w0.2: v1(61.1,63.8) 61.1,62 60.6,61.5 v1(59.9,61.5)
DIN: length 42.4
  Top Layer w0.15: 31.15,5.14 31.15,6.85 v1(31.2,6.9) ; CN1.25 49.48,31.15 49.1,30.77 49.1,26 49.8,25.3 v1(50,25.3)
  Bottom Layer w0.15: v1(50,25.3) 47.8,25.3 47.4,24.9 47.4,24.5 49.3,22.6 49.3,17.1 40.2,8 32.3,8 v1(31.2,6.9)
FAN_PWM: length 33.2
  Top Layer w0.15: 49.84,29.95 49.85,29.95 51.15,29.95 v1(51.3,29.8)
  Top Layer w0.2: FAN.2 47.7,5.9 v1(48.1,6.3)
  Bottom Layer w0.15: v1(51.3,29.8) 51.8,29.8 55.2,26.4 55.2,20.2 53.2,18.2 53.2,7.9 51.6,6.3 v1(48.1,6.3)
FAN_TACHO: length 33.4
  Top Layer w0.15: v1(47.4,29.2) 46.82,29.2 46.76,29.15
  Top Layer w0.2: FAN.4 49.7,6.6 v1(49.9,6.8)
  Bottom Layer w0.15: v1(49.9,6.8) 51.5,6.8 52.8,8.1 52.8,18.3 54.82,20.32 54.82,26.18 51.8,29.2 v1(47.4,29.2)
GPIO4: length 46.2
  Top Layer w0.15: v1(47.5,25.7) 47.93,26.13 47.93,34.67 47.67,34.93 47.67,36.43 47.35,36.75 CN1.54 ; v1(30.2,6.5) 30.15,6.45 30.15,5.14
  Bottom Layer w0.15: v1(30.2,6.5) 30.2,6.5 32.1,8.4 40.1,8.4 49,17.3 49,22.2 47,24.2 47,25.2 v1(47.5,25.7)
GPIO5: length 43.3
  Top Layer w0.15: CN1.34 46.28,32.75 45.4,31.87 45.4,25.8 v1(45.2,25.6) ; 29.65,5.14 29.65,6.75 v1(29.7,6.8)
  Bottom Layer w0.15: v1(45.2,25.6) 46.2,25.6 46.6,25.2 46.6,24 48.7,21.9 48.7,17.5 40,8.8 31.7,8.8 v1(29.7,6.8)
GPIO6: length 41.6
  Top Layer w0.15: 29.15,5.14 29.15,7.05 v1(29.2,7.1) ; v1(46,24.9) 45.7,25.2 45.7,31.37 46.28,31.95 CN1.30
  Bottom Layer w0.15: v1(46,24.9) 46,23.9 48.4,21.5 48.4,17.7 39.9,9.2 31.3,9.2 v1(29.2,7.1)
GPIO7: length 47.7
  Top Layer w0.15: v1(28.7,7.4) 28.65,7.35 28.65,5.14 ; CN1.37 49.45,33.55 48.8,32.9 48.8,25.77 49.7,24.87 49.7,24.1 49.3,23.7 v1(45.6,23.7)
  Bottom Layer w0.15: v1(28.7,7.4) 30.9,9.6 39.8,9.6 48.1,17.9 48.1,21.2 v1(45.6,23.7)
GPIO8: length 48.6
  Top Layer w0.15: v1(45,24.2) 48.8,24.2 49.1,24.5 49.1,24.9 48.5,25.5 48.5,33.1 49.35,33.95 CN1.39 ; 28.15,5.14 28.15,7.65 v1(28.2,7.7)
  Bottom Layer w0.15: v1(45,24.2) 45,23.6 47.8,20.8 47.8,18.1 39.7,10 30.5,10 v1(28.2,7.7)
GPO: length 8.4
  Top Layer w0.2: v1(56.7,62.4) 56.7,62.7 56.97,62.97 57.3,62.97 ; v1(57.3,59) 55.6,59 55.3,58.7 U30.A1
  Bottom Layer w0.2: v1(56.7,62.4) 58.2,60.9 58.2,59.1 58.1,59 v1(57.3,59)
HDMI0_CEC: length 36
  Top Layer w0.15: 10.1,62.38 10.1,46.7 v1(11,45.8) ; 15.83,36.35 16.75,36.35 v1(16.8,36.4)
  Bottom Layer w0.15: v1(16.8,36.4) 19.6,39.2 19.6,44 17.8,45.8 v1(11,45.8)
HDMI0_CLK_N: length 21.7
  Top Layer w0.177: CN2.90 12.25,43.95 12.22,43.91 10.58,43.91 10.4,44.09 10.4,44.6 10.2,44.8 9.66,44.8 9.5,44.96 9.5,46.73 9.8,47.03 9.8,47.44 9.5,47.74 9.5,61.22 9.26,61.46 9.26,61.55 9.3,61.59 9.3,62.38
HDMI0_CLK_P: length 21.7
  Top Layer w0.177: 8.9,62.38 8.9,61.59 8.94,61.55 8.94,61.33 9.17,61.09 9.17,44.83 10.42,43.58 12.22,43.58 12.25,43.55 CN2.88
HDMI0_HOTPLUG: length 36.1
  Top Layer w0.15: v1(17.7,36.6) 17.3,36.6 17,36.9 16.6,36.9 16.45,36.75 15.83,36.75 ; 12.1,62.38 12.1,60.8 11.3,60 11.3,47.6 11.7,47.2 v1(12.2,47.2)
  Bottom Layer w0.15: v1(17.7,36.6) 19.9,38.8 19.9,44.9 18,46.8 12.8,46.8 12.4,47.2 v1(12.2,47.2)
HDMI0_SCL: length 18
  Top Layer w0.15: 10.5,62.38 10.5,47.1 11.65,45.95 12.75,45.95
HDMI0_SDA: length 22.5
  Top Layer w0.15: 10.9,62.38 10.9,47.3 11.6,46.6 v1(12.2,46.6) ; v1(16.8,46.3) 16.45,45.95 15.83,45.95
  Bottom Layer w0.15: v1(16.8,46.3) 12.5,46.3 v1(12.2,46.6)
HDMI0_TX0_N: length 23.7
  Top Layer w0.177: CN2.84 12.25,42.75 12.22,42.71 10.09,42.71 9.74,43.06 9.74,43.31 9.84,43.41 9.84,43.66 9.39,44.11 9.14,44.11 9.04,44.01 8.79,44.01 8.7,44.1 8.7,60.82 8.06,61.46 8.06,61.55 8.1,61.59 8.1,62.38
HDMI0_TX0_P: length 23.7
  Top Layer w0.177: 7.7,62.38 7.7,61.59 7.74,61.55 7.74,61.33 8.37,60.69 8.37,43.96 9.96,42.38 12.22,42.38 12.25,42.35 CN2.82
HDMI0_TX1_N: length 25.7
  Top Layer w0.177: 6.9,62.38 6.9,61.59 6.86,61.55 6.86,61.46 7.9,60.42 7.9,43.2 8.3,42.8 8.55,42.8 8.65,42.9 8.9,42.9 9.36,42.44 9.36,42.19 9.26,42.09 9.26,41.84 9.59,41.51 12.22,41.51 12.25,41.55 CN2.78
HDMI0_TX1_P: length 25.7
  Top Layer w0.177: 6.5,62.38 6.5,61.59 6.54,61.55 6.54,61.33 7.57,60.29 7.57,43.06 9.46,41.18 12.22,41.18 12.25,41.15 CN2.76
HDMI0_TX2_N: length 27.8
  Top Layer w0.177: 5.7,62.38 5.7,61.59 5.66,61.55 5.66,61.46 7.1,60.02 7.1,42.2 7.62,41.68 7.88,41.68 7.97,41.77 8.23,41.77 8.68,41.32 8.68,41.07 8.58,40.97 8.58,40.72 8.99,40.31 12.22,40.31 12.25,40.35 CN2.72
HDMI0_TX2_P: length 27.7
  Top Layer w0.177: 5.3,62.38 5.3,61.59 5.34,61.55 5.34,61.33 6.77,59.89 6.77,42.06 8.86,39.98 12.22,39.98 12.25,39.95 CN2.70
HDMI_5V: length 18.7
  Top Layer w0.2: v1(11.6,61.3) 11.7,61.4 11.7,62.38
  Top Layer w0.4: v1(3.67,54.5) 4.02,54.15 U29.1 ; C119.2 1.1,56.9 v1(2.3,56.9)
  Bottom Layer w0.4: v1(11.6,61.3) 11,60.7 6.5,60.7 5.6,59.8 5.6,57.9 4.6,56.9 v1(2.3,56.9) 2.3,55.87 v1(3.67,54.5)
I2C2-SCL: length 44.8
  Top Layer w0.15: CN1.56 47.45,37.15 48.1,36.5 v1(48.1,36.2) ; v1(68,5.4) 68,6.4 I2C-SW.6
  Bottom Layer w0.15: v1(68,5.4) 68,5.12 67.78,4.9 67.2,4.9 66.6,5.5 66.6,15.2 64.9,16.9 64.9,20.9 59.2,26.6 58.8,26.6 56,29.4 54.1,29.4 48.1,35.4 v1(48.1,36.2)
I2C2-SDA: length 43.8
  Top Layer w0.15: I2C-SW.5 67.4,6.4 v1(67.4,5.4) ; v1(48.6,35.8) 48.6,36.6 47.65,37.55 CN1.58
  Bottom Layer w0.15: v1(67.4,5.4) 67,5.8 67,15.34 65.3,17.04 65.3,21.1 59.4,27 59,27 56.2,29.8 54.2,29.8 48.6,35.4 v1(48.6,35.8)
I2C-SCL: length 85.2
  Top Layer w0.15: v1(55.5,56.7) 55.5,57.31 55.11,57.7 U30.A3 ; v1(67.9,10.5) 67.73,10.5 67.18,9.95 66.97,9.95 ; 66.97,9.95 66.97,8.63 67.2,8.4 67.7,8.4 67.95,8.65 I2C-SW.3 ; 66.97,9.95 MCU.42
  Top Layer w0.2: v1(51.8,45.6) 51.8,46.36 52.68,47.24 52.68,47.6 55.25,50.17 55.25,54.54 55.45,54.74 55.45,56.65 v1(55.5,56.7) 56.1,57.3 60.4,57.3 60.75,56.95 U23.5 ; v1(54.9,61.2) U24.7 ; 64.7,17.23 64.7,18.5 65.6,19.4 v1(66.1,19.4)
  Bottom Layer w0.15: v1(51.8,45.6) 51.8,44.8 51.1,44.1 47.5,44.1 46.7,43.3 46.7,41.3 48,40 48,37.11 49.1,36.01 49.1,35.5 54.4,30.2 56.4,30.2 59.2,27.4 59.7,27.4 66.1,21 v1(66.1,19.4) 66.1,17.6 68.3,15.4 68.3,11.5 67.9,11.1 v1(67.9,10.5)
  Bottom Layer w0.2: v1(54.9,61.2) 55.8,61.2 56.3,60.7 56.3,59.54 55.25,58.49 55.25,57.55 55.5,57.3 v1(55.5,56.7)
I2C-SDA: length 83.2
  Top Layer w0.15: I2C-SW.4 67.45,9.69 67.76,10 68.3,10 68.6,10.3 v1(68.6,11) 67.7,11 67.15,10.45 MCU.43
  Top Layer w0.2: U24.6 55.1,61.7 v1(54.9,61.9) ; v1(55.7,57.8) 55.3,58.2 U30.A2 ; v1(67.2,17.4) 66.17,17.4 66,17.23 ; v1(52.3,46.1) 53.01,46.81 53.01,47.4 55.6,49.99 55.6,54.36 55.8,54.56 55.8,56.3 v1(56.2,56.7) 56.4,56.9 59.95,56.9 U23.6
  Bottom Layer w0.15: v1(52.3,46.1) 52.3,44.87 51.13,43.7 47.6,43.7 47.1,43.2 47.1,41.5 48.4,40.2 48.4,37.2 49.4,36.2 49.4,35.8 54.6,30.6 56.6,30.6 59.4,27.8 60,27.8 66.6,21.2 66.6,18 v1(67.2,17.4) 68.7,15.9 68.7,11.1 v1(68.6,11)
  Bottom Layer w0.2: v1(55.7,57.8) 56.2,57.3 v1(56.2,56.7) 56.8,57.3 56.8,61.1 56,61.9 v1(54.9,61.9)
ID_SC: length 115.2
  Top Layer w0.15: CN1.35 50.65,33.15 51.13,32.67 51.13,31.72 50.91,31.5 v1(50.7,31.5) ; 5.91,38.15 6.85,38.15 v1(7,38) ; v1(41.4,44.9) R4.2
  Bottom Layer w0.15: v1(50.7,31.5) 49.9,31.5 47.6,33.8 47.6,39.7 44.87,42.42 44.87,44.23 44.2,44.9 v1(41.4,44.9) 22.6,44.9 21.7,44 21.7,36.8 21.1,36.2 21.1,22.3 9,10.2 6.4,10.2 5.5,11.1 5.5,21.3 6.7,22.5 6.7,37.7 v1(7,38)
ID_SD: length 109.5
  Top Layer w0.15: 46.76,33.15 47.25,33.15 v1(47.4,33.3) ; 5.91,38.65 v1(7,38.65) ; v1(42.8,44.4) R5.2
  Bottom Layer w0.15: v1(7,38.65) 6.4,38.05 6.4,22.6 5.2,21.4 5.2,11 6.3,9.9 9.2,9.9 21.4,22.1 21.4,36 22,36.6 22,43.9 22.5,44.4 v1(42.8,44.4) 44.1,44.4 44.5,44 44.5,42.2 47.2,39.5 47.2,33.5 v1(47.4,33.3)
LED_NACT: length 4
  Top Layer w0.2: 53.6,30.97 52.98,30.35 49.84,30.35
LRCK: length 40.6
  Top Layer w0.15: CN1.26 46.28,31.15 46,30.87 46,25.6 46.9,24.7 v1(47.9,24.7) ; v1(31.7,6.6) 31.65,6.55 31.65,5.14
  Bottom Layer w0.15: v1(31.7,6.6) 32.7,7.6 40.3,7.6 49.6,16.9 49.6,23.1 48,24.7 v1(47.9,24.7)
MIPI0_C_N: length 27.5
  Top Layer w0.177: v1(7.36,15.23) 7.36,15.4 7.3,15.46 6.58,15.46 6.49,15.38 5.91,15.38 ; v1(17.95,31.38) 17.95,31.52 17.89,31.58 16.31,31.58 16.27,31.55 15.83,31.55
  Bottom Layer w0.177: v1(17.95,31.38) 17.76,31.57 14.17,31.57 10.3,27.7 10.3,17.3 8.47,15.47 7.89,15.47 7.65,15.23 v1(7.36,15.23)
MIPI0_C_P: length 27.5
  Top Layer w0.177: v1(17.95,32.08) 17.95,31.97 17.89,31.91 16.31,31.91 16.27,31.95 15.83,31.95 ; v1(7.36,16.03) 7.36,15.85 7.3,15.79 6.58,15.79 6.49,15.88 5.91,15.88
  Bottom Layer w0.177: v1(17.95,32.08) 17.76,31.9 14.03,31.9 9.97,27.84 9.97,17.44 8.33,15.79 7.89,15.79 7.65,16.03 v1(7.36,16.03)
MIPI0_D0_N: length 30.2
  Top Layer w0.177: 5.91,12.38 6.49,12.38 6.58,12.46 7.3,12.46 7.36,12.4 v1(7.36,12.23) ; v1(18.95,28.98) 18.95,29.12 18.89,29.18 16.31,29.18 16.27,29.15 15.83,29.15
  Bottom Layer w0.177: v1(7.36,12.23) 7.65,12.23 7.89,12.47 8.47,12.47 11.7,15.7 11.7,26.84 14.03,29.17 18.76,29.17 v1(18.95,28.98)
MIPI0_D0_P: length 30.2
  Top Layer w0.177: v1(7.36,13.03) 7.36,12.85 7.3,12.79 6.58,12.79 6.49,12.88 5.91,12.88 ; v1(18.95,29.68) 18.95,29.57 18.89,29.51 16.31,29.51 16.27,29.55 15.83,29.55
  Bottom Layer w0.177: v1(18.95,29.68) 18.76,29.5 13.9,29.5 11.37,26.97 11.37,15.84 8.33,12.79 7.89,12.79 7.65,13.03 v1(7.36,13.03)
MIPI0_D1_N: length 28.7
  Top Layer w0.177: v1(7.36,13.73) 7.36,13.9 7.3,13.96 6.58,13.96 6.49,13.88 5.91,13.88 ; v1(18.35,30.18) 18.35,30.32 18.29,30.38 16.31,30.38 16.27,30.35 15.83,30.35
  Bottom Layer w0.177: v1(18.35,30.18) 18.16,30.37 14.07,30.37 11,27.3 11,16.44 8.53,13.97 7.89,13.97 7.65,13.73 v1(7.36,13.73)
MIPI0_D1_P: length 28.7
  Top Layer w0.177: v1(7.36,14.53) 7.36,14.35 7.3,14.29 6.58,14.29 6.49,14.38 5.91,14.38 ; 15.83,30.75 16.27,30.75 16.31,30.71 18.29,30.71 18.35,30.77 v1(18.35,30.88)
  Bottom Layer w0.177: v1(18.35,30.88) 18.16,30.7 13.93,30.7 10.67,27.44 10.67,16.57 8.39,14.29 7.89,14.29 7.65,14.53 v1(7.36,14.53)
MIPI0_D2_N: length 26.2
  Top Layer w0.177: v1(7.36,16.73) 7.36,16.9 7.3,16.96 6.58,16.96 6.49,16.88 5.91,16.88 ; 15.83,32.75 16.27,32.75 16.31,32.78 17.39,32.78 17.45,32.72 v1(17.45,32.58)
  Bottom Layer w0.177: v1(7.36,16.73) 7.65,16.73 7.89,16.97 8.53,16.97 9.6,18.04 9.6,28.1 14.27,32.77 17.26,32.77 v1(17.45,32.58)
MIPI0_D2_P: length 26.2
  Top Layer w0.177: v1(17.45,33.28) 17.45,33.17 17.39,33.11 16.31,33.11 16.27,33.15 15.83,33.15 ; v1(7.36,17.53) 7.36,17.35 7.3,17.29 6.58,17.29 6.49,17.38 5.91,17.38
  Bottom Layer w0.177: v1(7.36,17.53) 7.65,17.53 7.89,17.29 8.39,17.29 9.27,18.17 9.27,28.24 14.13,33.1 17.26,33.1 v1(17.45,33.28)
MIPI0_D3_N: length 24.7
  Top Layer w0.177: 15.83,33.95 16.27,33.95 16.31,33.98 16.89,33.98 16.95,33.92 v1(16.95,33.78) ; 5.91,18.38 6.49,18.38 6.58,18.46 7.3,18.46 7.36,18.4 v1(7.36,18.23)
  Bottom Layer w0.177: v1(7.36,18.23) 7.65,18.23 7.89,18.47 8.37,18.47 8.9,19 8.9,28.5 14.37,33.97 16.76,33.97 v1(16.95,33.78)
MIPI0_D3_P: length 24.7
  Top Layer w0.177: 5.91,18.88 6.49,18.88 6.58,18.79 7.3,18.79 7.36,18.85 v1(7.36,19.03) ; v1(16.95,34.48) 16.95,34.37 16.89,34.31 16.31,34.31 16.27,34.35 15.83,34.35
  Bottom Layer w0.177: v1(7.36,19.03) 7.65,19.03 7.89,18.79 8.23,18.79 8.57,19.14 8.57,28.64 14.23,34.3 16.76,34.3 v1(16.95,34.48)
MIPI1_C_N: length 21.8
  Top Layer w0.177: 5.91,32.15 6.49,32.15 6.58,32.24 7.12,32.24 7.18,32.18 v1(7.18,32.01) ; v1(17.47,43.39) 17.47,43.52 17.41,43.58 16.31,43.58 16.27,43.55 15.83,43.55
  Bottom Layer w0.177: v1(7.18,32.01) 7.47,32.01 7.71,32.25 8.35,32.25 10.9,34.8 10.9,40.5 13.97,43.57 17.29,43.57 v1(17.47,43.39)
MIPI1_C_P: length 21.8
  Top Layer w0.177: 5.91,32.65 6.49,32.65 6.58,32.57 7.12,32.57 7.18,32.63 v1(7.18,32.81) ; 15.83,43.95 16.27,43.95 16.31,43.91 17.41,43.91 17.47,43.97 v1(17.47,44.09)
  Bottom Layer w0.177: v1(7.18,32.81) 7.47,32.81 7.71,32.58 8.21,32.58 10.57,34.94 10.57,40.64 13.84,43.9 17.29,43.9 v1(17.47,44.09)
MIPI1_D0_N: length 24.6
  Top Layer w0.177: 15.83,41.15 16.27,41.15 16.31,41.18 18.41,41.18 18.47,41.12 v1(18.47,40.99) ; v1(7.18,29.01) 7.18,29.18 7.12,29.24 6.58,29.24 6.49,29.15 5.91,29.15
  Bottom Layer w0.177: v1(7.18,29.01) 7.47,29.01 7.71,29.25 8.31,29.25 12.3,33.24 12.3,39.9 13.57,41.17 18.29,41.17 v1(18.47,40.99)
MIPI1_D0_P: length 24.6
  Top Layer w0.177: v1(18.47,41.69) 18.47,41.57 18.41,41.51 16.31,41.51 16.27,41.55 15.83,41.55 ; v1(7.18,29.81) 7.18,29.63 7.12,29.57 6.58,29.57 6.49,29.65 5.91,29.65
  Bottom Layer w0.177: v1(18.47,41.69) 18.29,41.5 13.44,41.5 11.97,40.04 11.97,33.37 8.18,29.58 7.71,29.58 7.47,29.81 v1(7.18,29.81)
MIPI1_D1_N: length 23.2
  Top Layer w0.177: v1(17.97,42.19) 17.97,42.32 17.91,42.38 16.31,42.38 16.27,42.35 15.83,42.35 ; 5.91,30.65 6.49,30.65 6.58,30.74 7.12,30.74 7.18,30.68 v1(7.18,30.51)
  Bottom Layer w0.177: v1(17.97,42.19) 17.79,42.37 13.77,42.37 11.6,40.2 11.6,34 8.35,30.75 7.71,30.75 7.47,30.51 v1(7.18,30.51)
MIPI1_D1_P: length 23.2
  Top Layer w0.177: 15.83,42.75 16.27,42.75 16.31,42.71 17.91,42.71 17.97,42.77 v1(17.97,42.89) ; v1(7.18,31.31) 7.18,31.13 7.12,31.07 6.58,31.07 6.49,31.15 5.91,31.15
  Bottom Layer w0.177: v1(17.97,42.89) 17.79,42.7 13.64,42.7 11.27,40.34 11.27,34.14 8.21,31.08 7.71,31.08 7.47,31.31 v1(7.18,31.31)
MIPI1_D2_N: length 20.4
  Top Layer w0.177: 15.83,44.75 16.27,44.75 16.31,44.78 16.91,44.78 16.97,44.72 v1(16.97,44.59) ; 5.91,33.65 6.49,33.65 6.58,33.74 7.12,33.74 7.18,33.68 v1(7.18,33.51)
  Bottom Layer w0.177: v1(7.18,33.51) 7.47,33.51 7.71,33.75 8.35,33.75 10.2,35.6 10.2,40.8 14.17,44.77 16.79,44.77 v1(16.97,44.59)
MIPI1_D2_P: length 20.4
  Top Layer w0.177: 15.83,45.15 16.27,45.15 16.31,45.11 16.91,45.11 16.97,45.17 v1(16.97,45.29) ; 5.91,34.15 6.49,34.15 6.58,34.07 7.12,34.07 7.18,34.13 v1(7.18,34.31)
  Bottom Layer w0.177: v1(16.97,45.29) 16.79,45.1 14.04,45.1 9.87,40.94 9.87,35.74 8.21,34.08 7.71,34.08 7.47,34.31 v1(7.18,34.31)
MIPI1_D3_N: length 16
  Top Layer w0.177: 12.75,44.75 12.31,44.75 12.28,44.78 11.76,44.78 11.7,44.72 v1(11.7,44.59) ; 5.91,35.15 6.49,35.15 6.58,35.24 7.12,35.24 7.18,35.18 v1(7.18,35.01)
  Bottom Layer w0.177: v1(11.7,44.59) 11.48,44.81 10.08,44.81 9.5,44.24 9.5,36.4 8.35,35.25 7.71,35.25 7.47,35.01 v1(7.18,35.01)
MIPI1_D3_P: length 16
  Top Layer w0.177: 12.75,45.15 12.31,45.15 12.28,45.11 11.76,45.11 11.7,45.17 v1(11.7,45.29) ; v1(7.18,35.81) 7.18,35.63 7.12,35.57 6.58,35.57 6.49,35.65 5.91,35.65
  Bottom Layer w0.177: v1(11.7,45.29) 10.09,45.29 9.17,44.37 9.17,36.54 8.21,35.58 7.71,35.58 7.47,35.81 v1(7.18,35.81)
PI_PWR: length 9.3
  Top Layer w0.4: LED8.2 53.4,35.9 LED7.1 52.4,41.4 51.3,42.5
PI_PWR_EN: length 36.4
  Top Layer w0.15: 55.3,42.7 54.9,42.3 53.6,42.3 52.9,41.6 52.9,37.6 55,35.5 57,35.5 57.63,34.87 R72.1 57.63,33.97 58.2,33.4 58.2,31.8 61,29 61,19.1 59.7,17.8 59.7,16.3 58.85,15.45 MCU.12
  Top Layer w0.2: 55.3,42.7 U19.2
PI_STAT: length 42.9
  Top Layer w0.15: CN1.44 45.35,34.75 v1(45.2,34.9) ; v1(59.2,12.5) 58.75,12.95 MCU.13 ; v1(56.1,15.7) 53.9,15.7 53.5,16.1 45.2,16.1 v1(44.9,16.4)
  Bottom Layer w0.15: v1(56.1,15.7) 56.1,13.6 57.2,12.5 v1(59.2,12.5) ; v1(45.2,34.9) 46.4,33.7 46.4,28.2 44.2,26 44.2,23.6 47.2,20.6 47.2,18.7 v1(44.9,16.4)
PWR_BUTTON: length 70.2
  Top Layer w0.15: PWR-SW.2 17.8,3.2 18.01,3.2 18.51,3.7 27.2,3.7 27.65,4.15 Expansion.16 27.65,7.95 v1(27.7,8) ; v1(44,43.8) 44.55,44.35 46.76,44.35
  Bottom Layer w0.15: v1(44,43.8) 44,42.1 46.8,39.3 46.8,28.2 44.5,25.9 44.5,23.7 47.5,20.7 47.5,18.3 39.6,10.4 30.1,10.4 v1(27.7,8)
REGN: length 12.2
  Top Layer w0.2: 56.47,55.26 56.64,55.26 v1(57.2,54.7)
  Bottom Layer w0.2: v1(65.5,55.7) 64.6,54.8 63.13,54.8 61.03,56.9 58.4,56.9 57,55.5 57,54.9 v1(57.2,54.7)
RST: length 64.1
  Top Layer w0.15: 54.2,3.4 54.2,2.88 53.52,2.2 53.16,2.56 52.3,2.56
  Top Layer w0.2: v1(62.2,12.1) 61.35,12.95 MCU.7 ; MCU_PROG.1 30.92,13.4 49.1,13.4 51.1,11.4 51.1,6.5 54.2,3.4 56.6,3.4 58.2,5 58.2,6.5 58.9,7.2 v1(59.2,7.2)
  Bottom Layer w0.2: v1(59.2,7.2) 59.3,7.1 64.33,7.1 65.3,8.07 65.3,12.4 64.2,13.5 62.8,13.5 62.2,12.9 v1(62.2,12.1)
SCL0: length 82.1
  Top Layer w0.15: v1(7,21.3) 6.92,21.38 5.91,21.38 ; 46.76,41.95 45.95,41.95 v1(45.8,42.1)
  Bottom Layer w0.15: v1(45.8,42.1) 45.8,44.8 44.9,45.7 22.6,45.7 21.1,44.2 21.1,37.2 20.5,36.6 20.5,22.7 8.6,10.8 6.8,10.8 6.1,11.5 6.1,20.4 v1(7,21.3)
SD_CLK: length 25.6
  Top Layer w0.15: 49.84,37.55 49.25,37.55 v1(49.2,37.6)
  Top Layer w0.2: SD.5 66.68,22.72 v1(66.2,23.2)
  Bottom Layer w0.15: v1(66.2,23.2) 60.8,28.6 59.8,28.6 57,31.4 55,31.4 50.2,36.2 50.2,37.2 49.8,37.6 v1(49.2,37.6)
SD_CMD: length 30.4
  Top Layer w0.15: SD.3 66.62,24.92 65.6,23.9 65.6,23 v1(66.2,22.4) ; 46.76,38.35 47.64,38.35 48.99,37 v1(49.2,37)
  Bottom Layer w0.15: v1(49.2,37) 49.46,37 49.8,36.66 49.8,36 54.8,31 56.8,31 59.6,28.2 60.4,28.2 v1(66.2,22.4)
SD_DAT0: length 29.5
  Top Layer w0.15: v1(51,38.7) 50.95,38.75 49.84,38.75 ; SD.7 68.22,20.52 v1(68.4,20.7)
  Bottom Layer w0.15: v1(68.4,20.7) 68.4,22.6 61.6,29.4 60.2,29.4 57.4,32.2 55.4,32.2 51.2,36.4 51.2,38.5 v1(51,38.7)
SD_DAT1: length 32.3
  Top Layer w0.15: SD.8 68.72,19.42 v1(69,19.7) ; 49.84,39.55 51.05,39.55 v1(51.2,39.4)
  Bottom Layer w0.15: v1(69,19.7) 69,22.7 61.9,29.8 60.4,29.8 57.6,32.6 55.6,32.6 51.65,36.55 51.65,38.39 51.5,38.54 51.5,39.1 v1(51.2,39.4)
SD_DAT2: length 24.5
  Top Layer w0.15: SD.1 67.15,26.9 v1(65.6,26.9) ; v1(51.35,39.95) 49.84,39.95
  Bottom Layer w0.15: v1(65.6,26.9) 62.25,30.25 60.55,30.25 57.8,33 55.8,33 52.1,36.7 52.1,38.4 51.95,38.55 51.95,39.35 v1(51.35,39.95)
SD_DAT3: length 25.4
  Top Layer w0.15: v1(65.6,24.6) 65.6,25.5 66.12,26.02 SD.2 ; 49.84,38.35 50.55,38.35 v1(50.7,38.2)
  Bottom Layer w0.15: v1(50.7,38.2) 50.7,36.3 55.2,31.8 57.2,31.8 60,29 61.2,29 v1(65.6,24.6)
SD_PWR: length 10.3
  Top Layer w0.5: SD.4 68.42,23.82 v1(68.7,24.1)
  Bottom Layer w0.5: v1(67.6,32.2) 69,30.8 69,24.4 v1(68.7,24.1)
SD_PWR_ON: length 24.2
  Top Layer w0.15: v1(63.7,33.6) 63.15,34.15 62.86,34.15 ; 49.84,41.15 50.45,41.15 50.8,40.8 v1(50.8,40.5)
  Bottom Layer w0.15: v1(50.8,40.5) 51.5,40.5 52.6,39.4 52.6,36.8 56,33.4 58,33.4 60.7,30.7 63.6,30.7 64.2,31.3 64.2,33.1 v1(63.7,33.6)
SDA0: length 83
  Top Layer w0.15: v1(45.3,42.7) 45.8,42.7 46.16,42.35 46.76,42.35 ; v1(7,22) 6.88,21.88 5.91,21.88
  Bottom Layer w0.15: v1(7,22) 5.8,20.8 5.8,11.3 6.6,10.5 8.8,10.5 20.8,22.5 20.8,36.4 21.4,37 21.4,44.1 22.63,45.33 44.77,45.33 45.5,44.6 45.5,42.9 v1(45.3,42.7)
SWCLK: length 43.5
  Top Layer w0.2: 32.44,17.2 32.44,17.06 35.5,14 49.3,14 51.6,11.7 51.6,6.8 54.3,4.1 v1(55.4,4.1) ; v1(65.8,6.8) 65.85,6.85 MCU.37
  Bottom Layer w0.2: v1(65.8,6.8) 65.6,6.6 58.4,6.6 56.3,4.5 55.8,4.5 v1(55.4,4.1)
SWDIO: length 39.5
  Top Layer w0.2: 34.7,17.2 37.3,14.6 49.5,14.6 52.1,12 52.1,7.1 54.52,4.68 55.52,4.68 v1(56.2,4) ; MCU.34 63.35,4.95 v1(63.4,4.9)
  Bottom Layer w0.2: v1(56.2,4) 56.3,4 58.4,6.1 62.2,6.1 v1(63.4,4.9)
USB2_N: length 29.3
  Top Layer w0.239: CN2.3 15.42,26.75 15.42,26.75 15.3,26.75 15,26.45 15,18.2 16.64,16.56 17.14,16.56 17.6,16.1 17.6,15.6 18.05,15.15 18.55,15.15 19.01,14.69 19.01,14.19 20.53,12.67 23.24,12.67 26.6,9.32 26.6,5.96 26.65,5.91 26.65,5.14
USB2_P: length 29.4
  Top Layer w0.239: 26.15,5.14 26.15,5.91 26.21,5.96 26.21,9.16 23.08,12.28 20.37,12.28 14.61,18.04 14.61,26.61 15.14,27.14 15.42,27.14 15.42,27.15 CN2.5
USB3-0-D_N: length 35.4
  Top Layer w0.239: CN2.36 13.16,33.15 13.17,33.14 13.45,33.14 13.89,32.7 13.89,17.21 19.9,11.2 22.65,11.2 25.6,8.25 25.6,5.96 25.65,5.91 25.65,5.14
USB3-0-D_P: length 35.4
  Top Layer w0.239: 25.15,5.14 25.15,5.91 25.21,5.96 25.21,8.09 22.49,10.81 19.74,10.81 17.17,13.38 16.62,13.38 16.19,13.81 16.19,14.36 15.75,14.8 15.2,14.8 14.77,15.23 14.77,15.78 13.5,17.05 13.5,32.54 13.29,32.75 13.17,32.75 13.16,32.75 CN2.34
